# EasyEDA Pro project Uuu_sourcefile.epro

# Schematic Schematic1
Board Name: Board1; Create Date: 2026-05-01; Page Name: P1; Project Name: project four; Schematic Name: Schematic1; Update Date: 2026-05-10; Company: EasyEDA.com; Page Size: A4; Version: V1.0
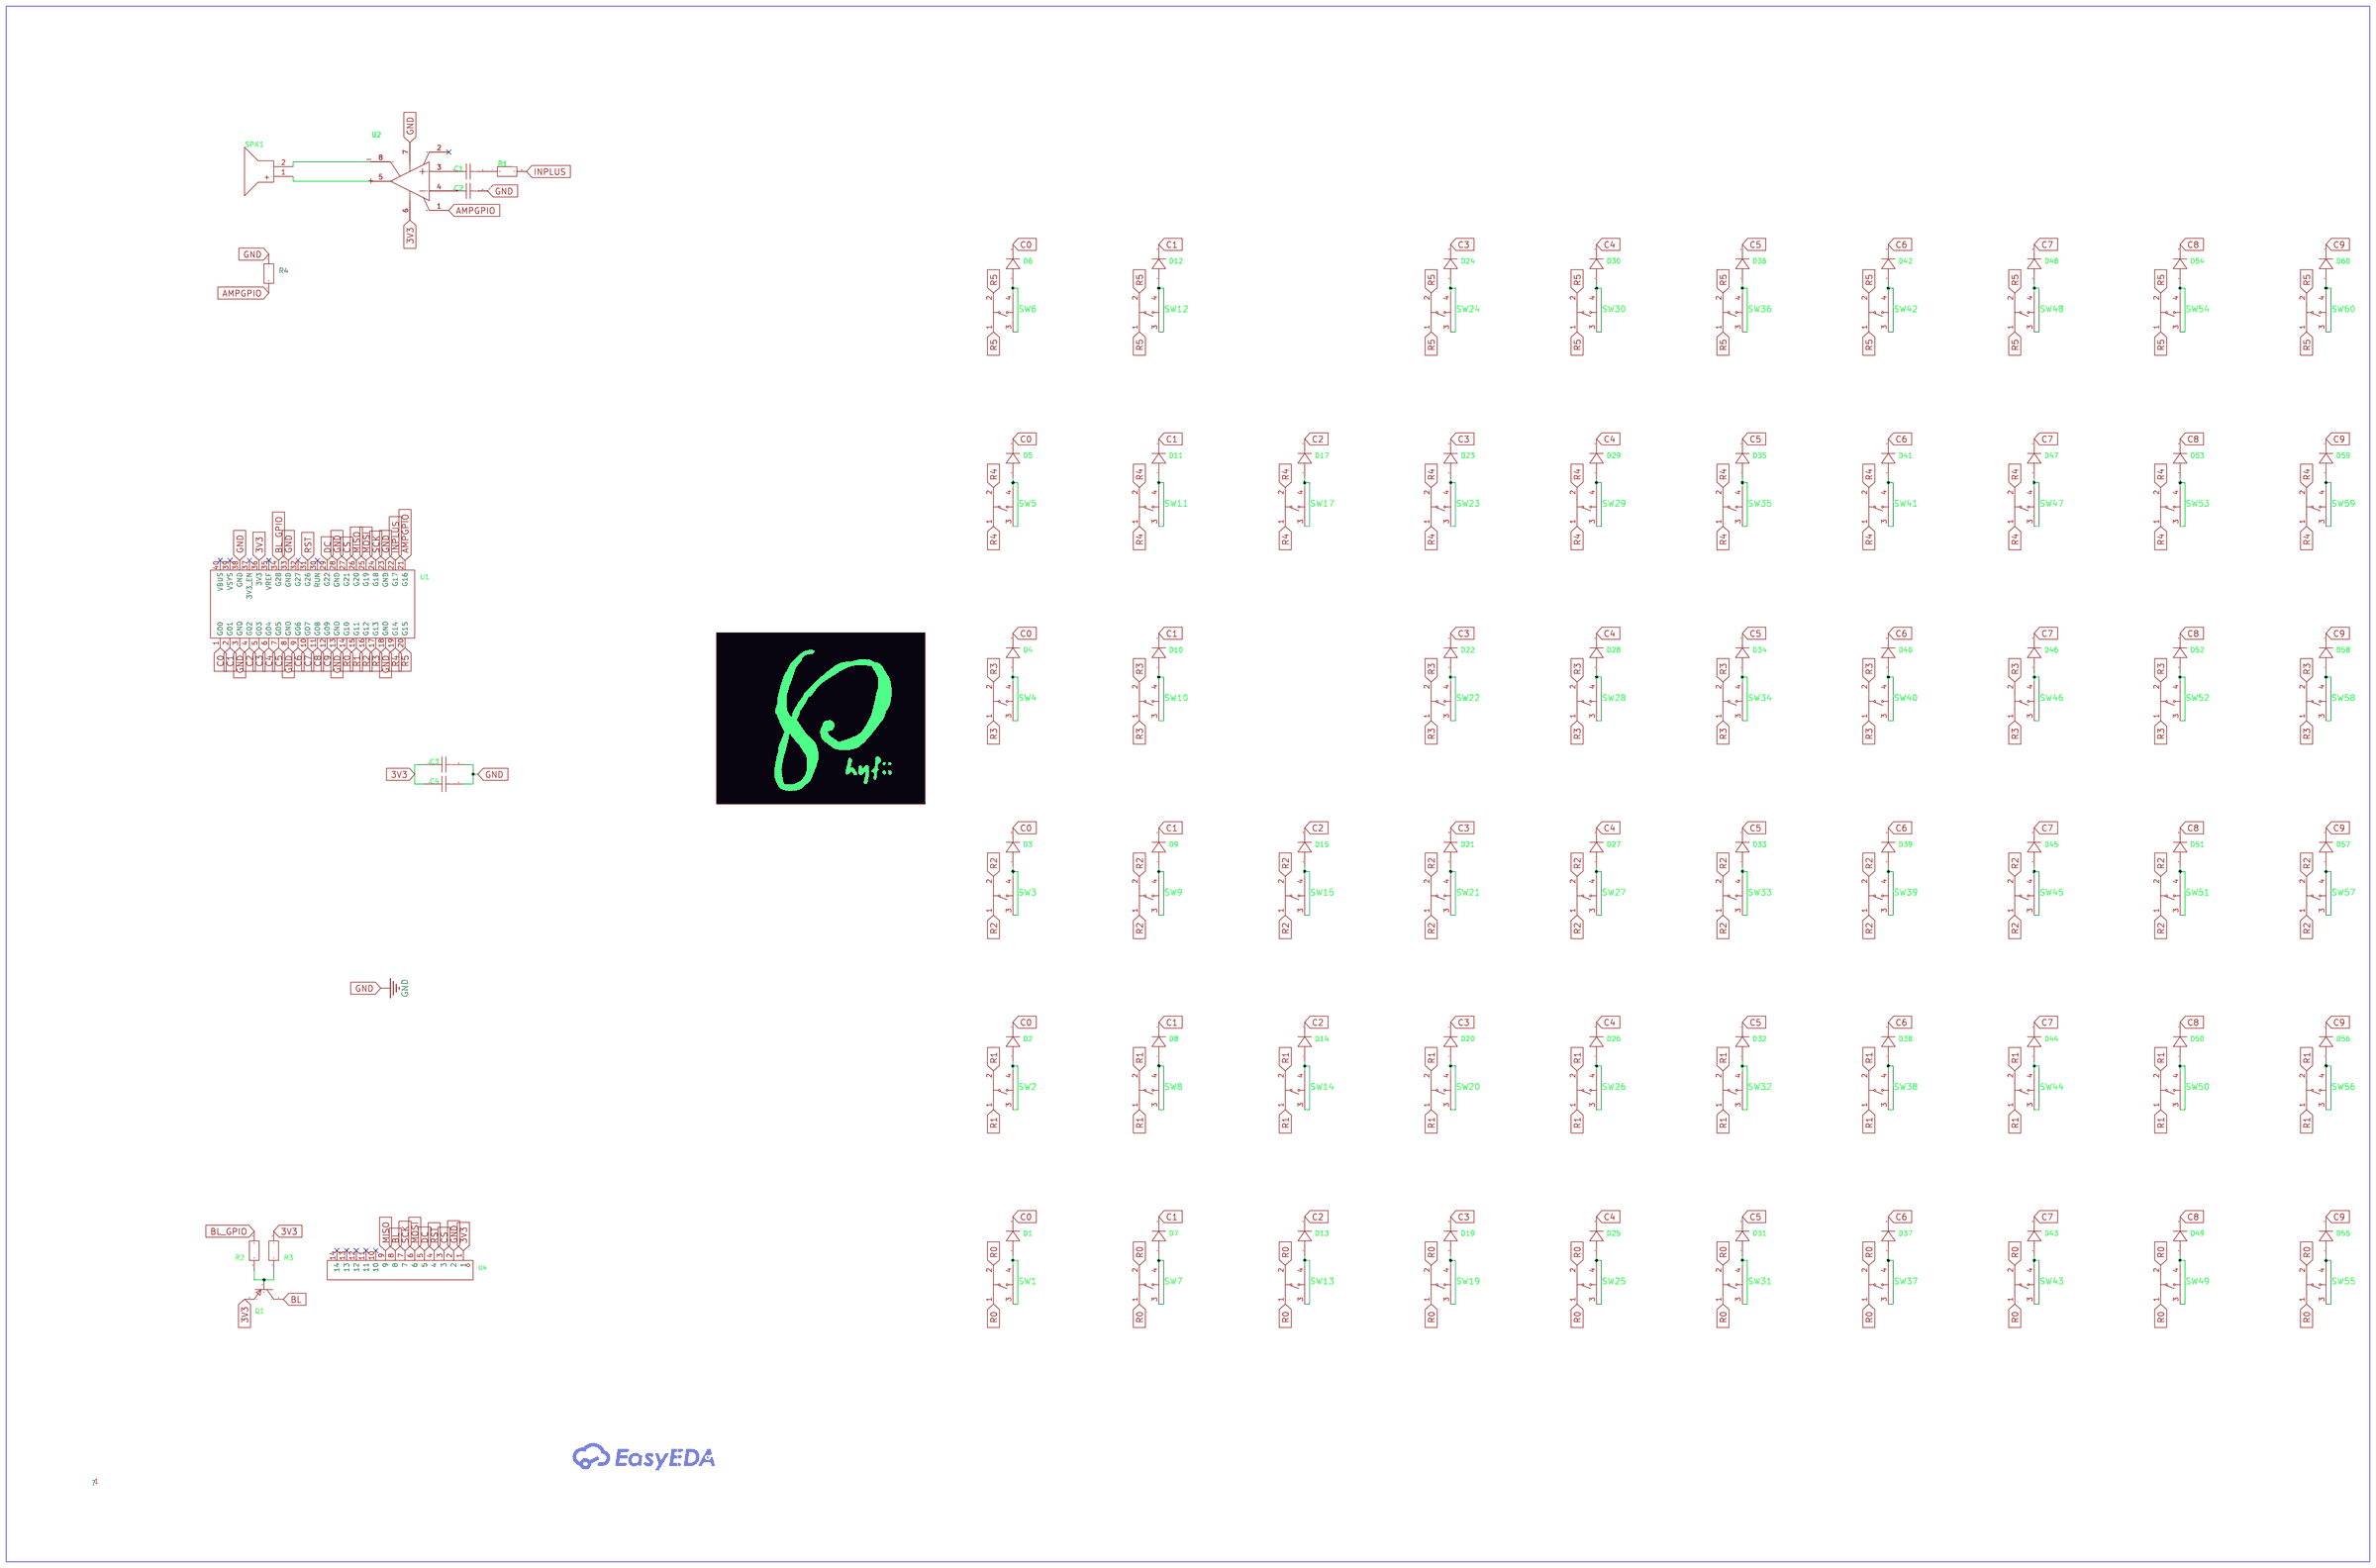
[diagram p0: schematic sheet]

## Parts
C1  100nF  [C0603]
C2  100nF  [C0603]
C3  1uF  [C0603]
C4  10uF  [C0603]
D1  1N4148  [DO-35_BD2.2-L4.0-D0.50_1N4148]
D2  1N4148  [DO-35_BD2.2-L4.0-D0.50_1N4148]
D3  1N4148  [DO-35_BD2.2-L4.0-D0.50_1N4148]
D4  1N4148  [DO-35_BD2.2-L4.0-D0.50_1N4148]
D5  1N4148  [DO-35_BD2.2-L4.0-D0.50_1N4148]
D6  1N4148  [DO-35_BD2.2-L4.0-D0.50_1N4148]
D7  1N4148  [DO-35_BD2.2-L4.0-D0.50_1N4148]
D8  1N4148  [DO-35_BD2.2-L4.0-D0.50_1N4148]
D9  1N4148  [DO-35_BD2.2-L4.0-D0.50_1N4148]
D10  1N4148  [DO-35_BD2.2-L4.0-D0.50_1N4148]
D11  1N4148  [DO-35_BD2.2-L4.0-D0.50_1N4148]
D12  1N4148  [DO-35_BD2.2-L4.0-D0.50_1N4148]
D13  1N4148  [DO-35_BD2.2-L4.0-D0.50_1N4148]
D14  1N4148  [DO-35_BD2.2-L4.0-D0.50_1N4148]
D15  1N4148  [DO-35_BD2.2-L4.0-D0.50_1N4148]
D17  1N4148  [DO-35_BD2.2-L4.0-D0.50_1N4148]
D19  1N4148  [DO-35_BD2.2-L4.0-D0.50_1N4148]
D20  1N4148  [DO-35_BD2.2-L4.0-D0.50_1N4148]
D21  1N4148  [DO-35_BD2.2-L4.0-D0.50_1N4148]
D22  1N4148  [DO-35_BD2.2-L4.0-D0.50_1N4148]
D23  1N4148  [DO-35_BD2.2-L4.0-D0.50_1N4148]
D24  1N4148  [DO-35_BD2.2-L4.0-D0.50_1N4148]
D25  1N4148  [DO-35_BD2.2-L4.0-D0.50_1N4148]
D26  1N4148  [DO-35_BD2.2-L4.0-D0.50_1N4148]
D27  1N4148  [DO-35_BD2.2-L4.0-D0.50_1N4148]
D28  1N4148  [DO-35_BD2.2-L4.0-D0.50_1N4148]
D29  1N4148  [DO-35_BD2.2-L4.0-D0.50_1N4148]
D30  1N4148  [DO-35_BD2.2-L4.0-D0.50_1N4148]
D31  1N4148  [DO-35_BD2.2-L4.0-D0.50_1N4148]
D32  1N4148  [DO-35_BD2.2-L4.0-D0.50_1N4148]
D33  1N4148  [DO-35_BD2.2-L4.0-D0.50_1N4148]
D34  1N4148  [DO-35_BD2.2-L4.0-D0.50_1N4148]
D35  1N4148  [DO-35_BD2.2-L4.0-D0.50_1N4148]
D36  1N4148  [DO-35_BD2.2-L4.0-D0.50_1N4148]
D37  1N4148  [DO-35_BD2.2-L4.0-D0.50_1N4148]
D38  1N4148  [DO-35_BD2.2-L4.0-D0.50_1N4148]
D39  1N4148  [DO-35_BD2.2-L4.0-D0.50_1N4148]
D40  1N4148  [DO-35_BD2.2-L4.0-D0.50_1N4148]
D41  1N4148  [DO-35_BD2.2-L4.0-D0.50_1N4148]
D42  1N4148  [DO-35_BD2.2-L4.0-D0.50_1N4148]
D43  1N4148  [DO-35_BD2.2-L4.0-D0.50_1N4148]
D44  1N4148  [DO-35_BD2.2-L4.0-D0.50_1N4148]
D45  1N4148  [DO-35_BD2.2-L4.0-D0.50_1N4148]
D46  1N4148  [DO-35_BD2.2-L4.0-D0.50_1N4148]
D47  1N4148  [DO-35_BD2.2-L4.0-D0.50_1N4148]
D48  1N4148  [DO-35_BD2.2-L4.0-D0.50_1N4148]
D49  1N4148  [DO-35_BD2.2-L4.0-D0.50_1N4148]
D50  1N4148  [DO-35_BD2.2-L4.0-D0.50_1N4148]
D51  1N4148  [DO-35_BD2.2-L4.0-D0.50_1N4148]
D52  1N4148  [DO-35_BD2.2-L4.0-D0.50_1N4148]
D53  1N4148  [DO-35_BD2.2-L4.0-D0.50_1N4148]
D54  1N4148  [DO-35_BD2.2-L4.0-D0.50_1N4148]
D55  1N4148  [DO-35_BD2.2-L4.0-D0.50_1N4148]
D56  1N4148  [DO-35_BD2.2-L4.0-D0.50_1N4148]
D57  1N4148  [DO-35_BD2.2-L4.0-D0.50_1N4148]
D58  1N4148  [DO-35_BD2.2-L4.0-D0.50_1N4148]
D59  1N4148  [DO-35_BD2.2-L4.0-D0.50_1N4148]
D60  1N4148  [DO-35_BD2.2-L4.0-D0.50_1N4148]
Q1  MMBT3906  [SOT-23-3_L2.9-W1.3-P1.90-LS2.4-BR]
R1  1kΩ  [R0603]
R2  10kΩ  [R0603]
R3  100kΩ  [R0603]
R4  100kΩ  [R0603]
SPK1  2308 8Ω1w  [SPK-TH_BD23.0-P10.00-D0.8-L-RD]
SW1  TS-1095PS-A1B2-C3D2  [KEY-SMD_4P-L6.0-W6.0-P3.90-LS9.0]
SW2  TS-1095PS-A1B2-C3D2  [KEY-SMD_4P-L6.0-W6.0-P3.90-LS9.0]
SW3  TS-1095PS-A1B2-C3D2  [KEY-SMD_4P-L6.0-W6.0-P3.90-LS9.0]
SW4  TS-1095PS-A1B2-C3D2  [KEY-SMD_4P-L6.0-W6.0-P3.90-LS9.0]
SW5  TS-1095PS-A1B2-C3D2  [KEY-SMD_4P-L6.0-W6.0-P3.90-LS9.0]
SW6  TS-1095PS-A1B2-C3D2  [KEY-SMD_4P-L6.0-W6.0-P3.90-LS9.0]
SW7  TS-1095PS-A1B2-C3D2  [KEY-SMD_4P-L6.0-W6.0-P3.90-LS9.0]
SW8  TS-1095PS-A1B2-C3D2  [KEY-SMD_4P-L6.0-W6.0-P3.90-LS9.0]
SW9  TS-1095PS-A1B2-C3D2  [KEY-SMD_4P-L6.0-W6.0-P3.90-LS9.0]
SW10  TS-1095PS-A1B2-C3D2  [KEY-SMD_4P-L6.0-W6.0-P3.90-LS9.0]
SW11  TS-1095PS-A1B2-C3D2  [KEY-SMD_4P-L6.0-W6.0-P3.90-LS9.0]
SW12  TS-1095PS-A1B2-C3D2  [KEY-SMD_4P-L6.0-W6.0-P3.90-LS9.0]
SW13  TS-1095PS-A1B2-C3D2  [KEY-SMD_4P-L6.0-W6.0-P3.90-LS9.0]
SW14  TS-1095PS-A1B2-C3D2  [KEY-SMD_4P-L6.0-W6.0-P3.90-LS9.0]
SW15  TS-1095PS-A1B2-C3D2  [KEY-SMD_4P-L6.0-W6.0-P3.90-LS9.0]
SW17  TS-1095PS-A1B2-C3D2  [KEY-SMD_4P-L6.0-W6.0-P3.90-LS9.0]
SW19  TS-1095PS-A1B2-C3D2  [KEY-SMD_4P-L6.0-W6.0-P3.90-LS9.0]
SW20  TS-1095PS-A1B2-C3D2  [KEY-SMD_4P-L6.0-W6.0-P3.90-LS9.0]
SW21  TS-1095PS-A1B2-C3D2  [KEY-SMD_4P-L6.0-W6.0-P3.90-LS9.0]
SW22  TS-1095PS-A1B2-C3D2  [KEY-SMD_4P-L6.0-W6.0-P3.90-LS9.0]
SW23  TS-1095PS-A1B2-C3D2  [KEY-SMD_4P-L6.0-W6.0-P3.90-LS9.0]
SW24  TS-1095PS-A1B2-C3D2  [KEY-SMD_4P-L6.0-W6.0-P3.90-LS9.0]
SW25  TS-1095PS-A1B2-C3D2  [KEY-SMD_4P-L6.0-W6.0-P3.90-LS9.0]
SW26  TS-1095PS-A1B2-C3D2  [KEY-SMD_4P-L6.0-W6.0-P3.90-LS9.0]
SW27  TS-1095PS-A1B2-C3D2  [KEY-SMD_4P-L6.0-W6.0-P3.90-LS9.0]
SW28  TS-1095PS-A1B2-C3D2  [KEY-SMD_4P-L6.0-W6.0-P3.90-LS9.0]
SW29  TS-1095PS-A1B2-C3D2  [KEY-SMD_4P-L6.0-W6.0-P3.90-LS9.0]
SW30  TS-1095PS-A1B2-C3D2  [KEY-SMD_4P-L6.0-W6.0-P3.90-LS9.0]
SW31  TS-1095PS-A1B2-C3D2  [KEY-SMD_4P-L6.0-W6.0-P3.90-LS9.0]
SW32  TS-1095PS-A1B2-C3D2  [KEY-SMD_4P-L6.0-W6.0-P3.90-LS9.0]
SW33  TS-1095PS-A1B2-C3D2  [KEY-SMD_4P-L6.0-W6.0-P3.90-LS9.0]
SW34  TS-1095PS-A1B2-C3D2  [KEY-SMD_4P-L6.0-W6.0-P3.90-LS9.0]
SW35  TS-1095PS-A1B2-C3D2  [KEY-SMD_4P-L6.0-W6.0-P3.90-LS9.0]
SW36  TS-1095PS-A1B2-C3D2  [KEY-SMD_4P-L6.0-W6.0-P3.90-LS9.0]
SW37  TS-1095PS-A1B2-C3D2  [KEY-SMD_4P-L6.0-W6.0-P3.90-LS9.0]
SW38  TS-1095PS-A1B2-C3D2  [KEY-SMD_4P-L6.0-W6.0-P3.90-LS9.0]
SW39  TS-1095PS-A1B2-C3D2  [KEY-SMD_4P-L6.0-W6.0-P3.90-LS9.0]
SW40  TS-1095PS-A1B2-C3D2  [KEY-SMD_4P-L6.0-W6.0-P3.90-LS9.0]
SW41  TS-1095PS-A1B2-C3D2  [KEY-SMD_4P-L6.0-W6.0-P3.90-LS9.0]
SW42  TS-1095PS-A1B2-C3D2  [KEY-SMD_4P-L6.0-W6.0-P3.90-LS9.0]
SW43  TS-1095PS-A1B2-C3D2  [KEY-SMD_4P-L6.0-W6.0-P3.90-LS9.0]
SW44  TS-1095PS-A1B2-C3D2  [KEY-SMD_4P-L6.0-W6.0-P3.90-LS9.0]
SW45  TS-1095PS-A1B2-C3D2  [KEY-SMD_4P-L6.0-W6.0-P3.90-LS9.0]
SW46  TS-1095PS-A1B2-C3D2  [KEY-SMD_4P-L6.0-W6.0-P3.90-LS9.0]
SW47  TS-1095PS-A1B2-C3D2  [KEY-SMD_4P-L6.0-W6.0-P3.90-LS9.0]
SW48  TS-1095PS-A1B2-C3D2  [KEY-SMD_4P-L6.0-W6.0-P3.90-LS9.0]
SW49  TS-1095PS-A1B2-C3D2  [KEY-SMD_4P-L6.0-W6.0-P3.90-LS9.0]
SW50  TS-1095PS-A1B2-C3D2  [KEY-SMD_4P-L6.0-W6.0-P3.90-LS9.0]
SW51  TS-1095PS-A1B2-C3D2  [KEY-SMD_4P-L6.0-W6.0-P3.90-LS9.0]
SW52  TS-1095PS-A1B2-C3D2  [KEY-SMD_4P-L6.0-W6.0-P3.90-LS9.0]
SW53  TS-1095PS-A1B2-C3D2  [KEY-SMD_4P-L6.0-W6.0-P3.90-LS9.0]
SW54  TS-1095PS-A1B2-C3D2  [KEY-SMD_4P-L6.0-W6.0-P3.90-LS9.0]
SW55  TS-1095PS-A1B2-C3D2  [KEY-SMD_4P-L6.0-W6.0-P3.90-LS9.0]
SW56  TS-1095PS-A1B2-C3D2  [KEY-SMD_4P-L6.0-W6.0-P3.90-LS9.0]
SW57  TS-1095PS-A1B2-C3D2  [KEY-SMD_4P-L6.0-W6.0-P3.90-LS9.0]
SW58  TS-1095PS-A1B2-C3D2  [KEY-SMD_4P-L6.0-W6.0-P3.90-LS9.0]
SW59  TS-1095PS-A1B2-C3D2  [KEY-SMD_4P-L6.0-W6.0-P3.90-LS9.0]
SW60  TS-1095PS-A1B2-C3D2  [KEY-SMD_4P-L6.0-W6.0-P3.90-LS9.0]
U1  ColorEasyPico2-RP2350  [COMM-TH_COLOREASYPICO2-RP2350]
U2  PAM8302AASCR  [MSOP-8_L3.0-W3.0-P0.65-LS5.0-BL]
U4  KH-2.54FH-1X14P-H8.5  [HDR-TH_14P-P2.54-V-F]

## Library data of the parts
C1 C2 = CGA0603X7R104K500JT: Capacitance:100nF Tolerance:±10% Tolerance:±10% Voltage Rating:50V Temperature Coefficient:X7R; LCSC Part Name: 100nF ±10% 50V; Supplier Part: C6119867; Manufacturer: HRE(芯声); Supplier Footprint: 0603; JLCPCB Part Class: Extended Part; Datasheet: https://item.szlcsc.com/datasheet/CGA0603X7R104K500JT/7062573.html; Supplier: LCSC; Tolerance: ±10%; Voltage Rating: 50V; Temperature Coefficient: X7R
C3 = CGA0603X5R105K500JT: Capacitance:1uF Tolerance:±10% Tolerance:±10% Voltage Rating:50V Temperature Coefficient:X5R; LCSC Part Name: 1uF ±10% 50V; Supplier Part: C6119852; Manufacturer: HRE(芯声); Supplier Footprint: 0603; JLCPCB Part Class: Extended Part; Datasheet: https://item.szlcsc.com/datasheet/CGA0603X5R105K500JT/7062558.html; Supplier: LCSC; Tolerance: ±10%; Voltage Rating: 50V; Temperature Coefficient: X5R
C4 = CGA0603X5R106K100JT: Capacitance:10uF Tolerance:±10% Tolerance:±10% Voltage Rating:10V Temperature Coefficient:X5R; LCSC Part Name: 10uF ±10% 10V; Supplier Part: C6119842; Manufacturer: HRE(芯声); Supplier Footprint: 0603; JLCPCB Part Class: Extended Part; Datasheet: https://item.szlcsc.com/datasheet/CGA0603X5R106K100JT/7062548.html; Supplier: LCSC; Tolerance: ±10%; Voltage Rating: 10V; Temperature Coefficient: X5R
D1-D15 D17 D19-D60 = 1N4148_C18195411: Voltage - Forward(Vf@If):1V@10mA Voltage - DC Reverse(Vr):100V Current - Rectified:150mA Pd - Power Dissipation:500mW Reverse Leakage Current (Ir):5mA Reverse Recovery Time (trr):4ns Operating Junction Temperature Range:-60℃~+200℃ Operating Junction Tempe; LCSC Part Name: 100V 150mA; Supplier Part: C18195411; Manufacturer: LJ(朗捷); Supplier Footprint: DO-35; JLCPCB Part Class: Extended Part; Datasheet: https://item.szlcsc.com/datasheet/1N4148/19344798.html; Supplier: LCSC; Voltage - Forward(Vf@If): 1V@10mA; Voltage - DC Reverse(Vr): 100V; Current - Rectified: 150mA; Pd - Power Dissipation: 500mW; Reverse Leakage Current (Ir): 5mA; Reverse Recovery Time (trr): 4ns; Operating Junction Temperature Range: -60℃~+200℃; Non-Repetitive Peak Forward Surge Current: 500mA
Q1 = MMBT3906_C5805820: type: Current - Collector(Ic):200mA Collector - Emitter Voltage VCEO:40V Pd - Power Dissipation: DC Current Gain:100@10mA,1V DC Current Gain:100@10mA,1V; Supplier Part: C5805820; Manufacturer: XZT(信展通); Supplier Footprint: SOT-23; JLCPCB Part Class: Extended Part; Datasheet: https://atta.szlcsc.com/upload/public/pdf/source/20230629/EDFB7D33DCE814F5A1700CFD3253DE4B.pdf; Supplier: LCSC; Current - Collector(Ic): 200mA; Collector - Emitter Voltage VCEO: 40V; DC Current Gain: 100@10mA,1V
R1 = FRC0603J102 TS: Type:Thick Film Resistor Resistance:1kΩ Tolerance:±5% Tolerance:±5% Power(Watts):100mW Voltage-Supply(Max):75V Temperature Coefficient:±100ppm/℃ Temperature Coefficient:±100ppm/℃ Operating Temperature:-55℃~+155℃ Operating Temperature:-55℃~+155℃; LCSC Part Name: 1kΩ ±5% 100mW 厚膜电阻; Supplier Part: C2907113; Manufacturer: FOJAN(富捷); Supplier Footprint: 0603; JLCPCB Part Class: Extended Part; Supplier: LCSC; Type: Thick Film Resistor; Tolerance: ±5%; Power(Watts): 100mW; Voltage-Supply(Max): 75V; Temperature Coefficient: ±100ppm/℃; Operating Temperature: -55℃~+155℃
R2 = FRC0603F1002TS: Type:Thick Film Resistor Resistance:10kΩ Tolerance:±1% Tolerance:±1% Power(Watts):100mW Voltage-Supply(Max):75V Temperature Coefficient:±100ppm/℃ Temperature Coefficient:±100ppm/℃ Operating Temperature:-55℃~+155℃ Operating Temperature:-55℃~+155℃; LCSC Part Name: 10kΩ ±1% 100mW 厚膜电阻; Supplier Part: C2906982; Manufacturer: FOJAN(富捷); Supplier Footprint: 0603; JLCPCB Part Class: Extended Part; Supplier: LCSC; Type: Thick Film Resistor; Tolerance: ±1%; Power(Watts): 100mW; Voltage-Supply(Max): 75V; Temperature Coefficient: ±100ppm/℃; Operating Temperature: -55℃~+155℃
R3 R4 = FRC0603J104 TS: Type:Thick Film Resistor Resistance:100kΩ Tolerance:±5% Tolerance:±5% Power(Watts):100mW Voltage-Supply(Max):75V Temperature Coefficient:±100ppm/℃ Temperature Coefficient:±100ppm/℃ Operating Temperature:-55℃~+155℃ Operating Temperature:-55℃~+155℃; LCSC Part Name: 100kΩ ±5% 100mW 厚膜电阻; Supplier Part: C2907088; Manufacturer: FOJAN(富捷); Supplier Footprint: 0603; JLCPCB Part Class: Extended Part; Supplier: LCSC; Type: Thick Film Resistor; Tolerance: ±5%; Power(Watts): 100mW; Voltage-Supply(Max): 75V; Temperature Coefficient: ±100ppm/℃; Operating Temperature: -55℃~+155℃
SPK1 = 2308 8Ω1w: Technology:Electromagnetic Frequency Range:1.65kHz~10kHz Frequency Range:1.65kHz~10kHz Impedance:8Ω Resonant Frequency:1.65kHz Rated Power:1W Sound Pressure Level(SPL):88dB Diameter(φD):23mm Height:8mm Operating Temperature:-20℃~+60℃ Operating Temperature; LCSC Part Name: 2308插针喇叭8欧1瓦带腔; Supplier Part: C49304674; Manufacturer: S&S(海旭); Supplier Footprint: 插件,D23xL8mm; JLCPCB Part Class: Extended Part; Datasheet: https://item.szlcsc.com/datasheet/2308%25208%25CE%25A91w/51765047.html; Supplier: LCSC; Technology: Electromagnetic; Frequency Range: 1.65kHz~10kHz; Impedance: 8Ω; Resonant Frequency: 1.65kHz; Rated Power: 1W; Sound Pressure Level(SPL): 88dB; Diameter(φD): 23mm; Height: 8mm; Operating Temperature: -20℃~+60℃; Lead Pitch: 10mm
SW1-SW15 SW17 SW19-SW60 = TS-1095PS-A1B2-C3D2: Circuit:SPST Actuator Style:Round Button Operating Force:1.8N Mounting Type:Surface Mount,Vertical Length:6mm Width:6mm Switch Height:4.3mm with Bracket:Without Bracket Actuator/Cap Color:Black Termination Style:Gull Wing Life:-; LCSC Part Name: 6*6*4.3mm 立贴 轻触开关; Supplier Part: C2834918; Manufacturer: Yuandi(元迪); Supplier Footprint: SMD-4P,6x6mm; JLCPCB Part Class: Extended Part; Datasheet: https://item.szlcsc.com/datasheet/TS-1095PS-A1B2-C3D2/2997598.html; Supplier: LCSC; Circuit: SPST; Actuator Style: Round Button; Operating Force: 1.8N; Mounting Type: Surface Mount,Vertical; Length: 6mm; Width: 6mm; Switch Height: 4.3mm; with Bracket: Without Bracket; Actuator/Cap Color: Black; Termination Style: Gull Wing
U1 = ColorEasyPico2-RP2350: LCSC Part Name: 立创·ColorEasyPico2开发板; Supplier Part: C42924268; Manufacturer: 立创开发板; JLCPCB Part Class: Extended Part; Datasheet: https://item.szlcsc.com/datasheet/ColorEasyPico2-RP2350/45024583.html; Supplier: LCSC
U2 = PAM8302AASCR: Class:Class D Speaker Channels:1-Channel Output Power:2.5Wx1@4Ω Voltage - Supply:2V~5.5V Voltage - Supply:2V~5.5V Total Harmonic Distortion + Noise (THD+N):0.3% Quiescent Current:4mA Operating Temperature:-40℃~+85℃ Operating Temperature:-40℃~+85℃ Signal-t; LCSC Part Name: 2.5W单声道D类音频功率放大器; Supplier Part: C113367; Manufacturer: DIODES(美台); Supplier Footprint: MSOP-8; JLCPCB Part Class: Extended Part; Datasheet: https://item.szlcsc.com/datasheet/PAM8302AASCR/114602.html; Supplier: LCSC; Class: Class D; Speaker Channels: 1-Channel; Output Power: 2.5Wx1@4Ω; Voltage - Supply: 2V~5.5V; Total Harmonic Distortion + Noise (THD+N): 0.3%; Quiescent Current: 4mA; Operating Temperature: -40℃~+85℃; Signal-to-Noise Ratio: 80dB; Power Supply Rejection Ratio (PSRR): 50dB; Efficiency: 85%
U4 = KH-2.54FH-1X14P-H8.5: Holes Structure:1x14P Pitch:2.54mm Row Spacing:- Circular Hole / Square Hole:Square Hole Mounting Type:Through Hole Number of Rows:1 Number of Positions:14P Current Rating:3A Voltage Rating (Max):- Holes Direction:Top Insulation Height:8.5mm Operating Tem; LCSC Part Name: 间距:2.54mm 1x14P 直插; Supplier Part: C2905420; Manufacturer: kinghelm(金航标); Supplier Footprint: 插件,P=2.54mm; JLCPCB Part Class: Extended Part; Datasheet: https://item.szlcsc.com/datasheet/KH-2.54FH-1X14P-H8.5/3175194.html; Supplier: LCSC; Holes Structure: 1x14P; Pitch: 2.54mm; Circular Hole / Square Hole: Square Hole; Mounting Type: Through Hole; Number of Rows: 1; Number of Positions: 14P; Current Rating: 3A; Holes Direction: Top; Insulation Height: 8.5mm; Operating Temperature: -40℃~+105℃

## Nets
3V3: C3.1 C4.1 Q1.2(E) R3.2 U1.36(3V3) U2.6(VDD) U4.1
GND: C2.2 C3.2 C4.2 R4.1 U1.3(GND) U1.8(GND) U1.13(GND) U1.18(GND) U1.23(GND) U1.28(GND) U1.33(GND) U1.38(GND) U2.7(GND) U4.2
AMPGPIO: R4.2 U1.21(G16) U2.1(SD#)
BL: Q1.3(C) U4.8
BL_GPIO: R2.2 U1.34(G28)
C0: D1.2(C) D2.2(C) D3.2(C) D4.2(C) D5.2(C) D6.2(C) U1.1(G00)
C1: D7.2(C) D8.2(C) D9.2(C) D10.2(C) D11.2(C) D12.2(C) U1.2(G01)
C2: D13.2(C) D14.2(C) D15.2(C) D17.2(C) U1.4(G02)
C3: D19.2(C) D20.2(C) D21.2(C) D22.2(C) D23.2(C) D24.2(C) U1.5(G03)
C4: D25.2(C) D26.2(C) D27.2(C) D28.2(C) D29.2(C) D30.2(C) U1.6(G04)
C5: D31.2(C) D32.2(C) D33.2(C) D34.2(C) D35.2(C) D36.2(C) U1.7(G05)
C6: D37.2(C) D38.2(C) D39.2(C) D40.2(C) D41.2(C) D42.2(C) U1.9(G06)
C7: D43.2(C) D44.2(C) D45.2(C) D46.2(C) D47.2(C) D48.2(C) U1.10(G07)
C8: D49.2(C) D50.2(C) D51.2(C) D52.2(C) D53.2(C) D54.2(C) U1.11(G08)
C9: D55.2(C) D56.2(C) D57.2(C) D58.2(C) D59.2(C) D60.2(C) U1.12(G09)
CS: U1.27(G21) U4.3
DC: U1.29(G22) U4.5
INPLUS: R1.2 U1.22(G17)
MISO: U1.26(G20) U4.9
MOSI: U1.25(G19) U4.6
R0: SW1.1 SW1.2 SW7.1 SW7.2 SW13.1 SW13.2 SW19.1 SW19.2 SW25.1 SW25.2 SW31.1 SW31.2 SW37.1 SW37.2 SW43.1 SW43.2 SW49.1 SW49.2 SW55.1 SW55.2 U1.14(G10)
R1: SW2.1 SW2.2 SW8.1 SW8.2 SW14.1 SW14.2 SW20.1 SW20.2 SW26.1 SW26.2 SW32.1 SW32.2 SW38.1 SW38.2 SW44.1 SW44.2 SW50.1 SW50.2 SW56.1 SW56.2 U1.15(G11)
R2: SW3.1 SW3.2 SW9.1 SW9.2 SW15.1 SW15.2 SW21.1 SW21.2 SW27.1 SW27.2 SW33.1 SW33.2 SW39.1 SW39.2 SW45.1 SW45.2 SW51.1 SW51.2 SW57.1 SW57.2 U1.16(G12)
R3: SW4.1 SW4.2 SW10.1 SW10.2 SW22.1 SW22.2 SW28.1 SW28.2 SW34.1 SW34.2 SW40.1 SW40.2 SW46.1 SW46.2 SW52.1 SW52.2 SW58.1 SW58.2 U1.17(G13)
R4: SW5.1 SW5.2 SW11.1 SW11.2 SW17.1 SW17.2 SW23.1 SW23.2 SW29.1 SW29.2 SW35.1 SW35.2 SW41.1 SW41.2 SW47.1 SW47.2 SW53.1 SW53.2 SW59.1 SW59.2 U1.19(G14)
R5: SW6.1 SW6.2 SW12.1 SW12.2 SW24.1 SW24.2 SW30.1 SW30.2 SW36.1 SW36.2 SW42.1 SW42.2 SW48.1 SW48.2 SW54.1 SW54.2 SW60.1 SW60.2 U1.20(G15)
RST: U1.31(G26) U4.4
SCK: U1.24(G18) U4.7
$1N8407: D1.1(A) SW1.3 SW1.4
$1N10171: D2.1(A) SW2.3 SW2.4
$1N10276: D4.1(A) SW4.3 SW4.4
$1N10284: D3.1(A) SW3.3 SW3.4
$1N10390: D6.1(A) SW6.3 SW6.4
$1N10398: D5.1(A) SW5.3 SW5.4
$1N11038: D11.1(A) SW11.3 SW11.4
$1N11044: D12.1(A) SW12.3 SW12.4
$1N11054: D10.1(A) SW10.3 SW10.4
$1N11060: D9.1(A) SW9.3 SW9.4
$1N11066: D8.1(A) SW8.3 SW8.4
$1N11072: D7.1(A) SW7.3 SW7.4
$1N11320: D13.1(A) SW13.3 SW13.4
$1N11326: D14.1(A) SW14.3 SW14.4
$1N11332: D15.1(A) SW15.3 SW15.4
$1N11344: D17.1(A) SW17.3 SW17.4
$1N11596: D19.1(A) SW19.3 SW19.4
$1N11602: D20.1(A) SW20.3 SW20.4
$1N11608: D21.1(A) SW21.3 SW21.4
$1N11614: D22.1(A) SW22.3 SW22.4
$1N11620: D23.1(A) SW23.3 SW23.4
$1N11626: D24.1(A) SW24.3 SW24.4
$1N11872: D25.1(A) SW25.3 SW25.4
$1N11878: D26.1(A) SW26.3 SW26.4
$1N11884: D27.1(A) SW27.3 SW27.4
$1N11890: D28.1(A) SW28.3 SW28.4
$1N11896: D29.1(A) SW29.3 SW29.4
$1N11902: D30.1(A) SW30.3 SW30.4
$1N12148: D31.1(A) SW31.3 SW31.4
$1N12154: D32.1(A) SW32.3 SW32.4
$1N12160: D33.1(A) SW33.3 SW33.4
$1N12166: D34.1(A) SW34.3 SW34.4
$1N12172: D35.1(A) SW35.3 SW35.4
$1N12178: D36.1(A) SW36.3 SW36.4
$1N12424: D37.1(A) SW37.3 SW37.4
$1N12430: D38.1(A) SW38.3 SW38.4
$1N12436: D39.1(A) SW39.3 SW39.4
$1N12442: D40.1(A) SW40.3 SW40.4
$1N12448: D41.1(A) SW41.3 SW41.4
$1N12454: D42.1(A) SW42.3 SW42.4
$1N12700: D43.1(A) SW43.3 SW43.4
$1N12706: D44.1(A) SW44.3 SW44.4
$1N12712: D45.1(A) SW45.3 SW45.4
$1N12718: D46.1(A) SW46.3 SW46.4
$1N12724: D47.1(A) SW47.3 SW47.4
$1N12730: D48.1(A) SW48.3 SW48.4
$1N12976: D49.1(A) SW49.3 SW49.4
$1N12982: D50.1(A) SW50.3 SW50.4
$1N12988: D51.1(A) SW51.3 SW51.4
$1N12994: D52.1(A) SW52.3 SW52.4
$1N13000: D53.1(A) SW53.3 SW53.4
$1N13006: D54.1(A) SW54.3 SW54.4
$1N13252: D55.1(A) SW55.3 SW55.4
$1N13258: D56.1(A) SW56.3 SW56.4
$1N13264: D57.1(A) SW57.3 SW57.4
$1N13270: D58.1(A) SW58.3 SW58.4
$1N13276: D59.1(A) SW59.3 SW59.4
$1N13282: D60.1(A) SW60.3 SW60.4
$1N22901: SPK1.2(-) U2.8(VO-)
$1N22906: SPK1.1(+) U2.5(VO+)
$1N23027: C1.1 U2.3(IN+)
$1N23100: C1.2 R1.1
$1N23235: C2.1 U2.4(IN-)
$1N52039: Q1.1(B) R2.1 R3.1

Not connected (* = marked no-connect by the designer): U1 30(RUN)* 32(G27)* 35(VREF)* 37(3V3_EN)* 39(VSYS)* 40(VBUS)*; U2 2(NC)*; U4 10* 11* 12* 13* 14*

## Notes on the sheet
- 58 button matrix (6 x 10) - 2
- speaker & amplifier
- microcontroller
- GND
- 14pin header for display

# Board PCB1
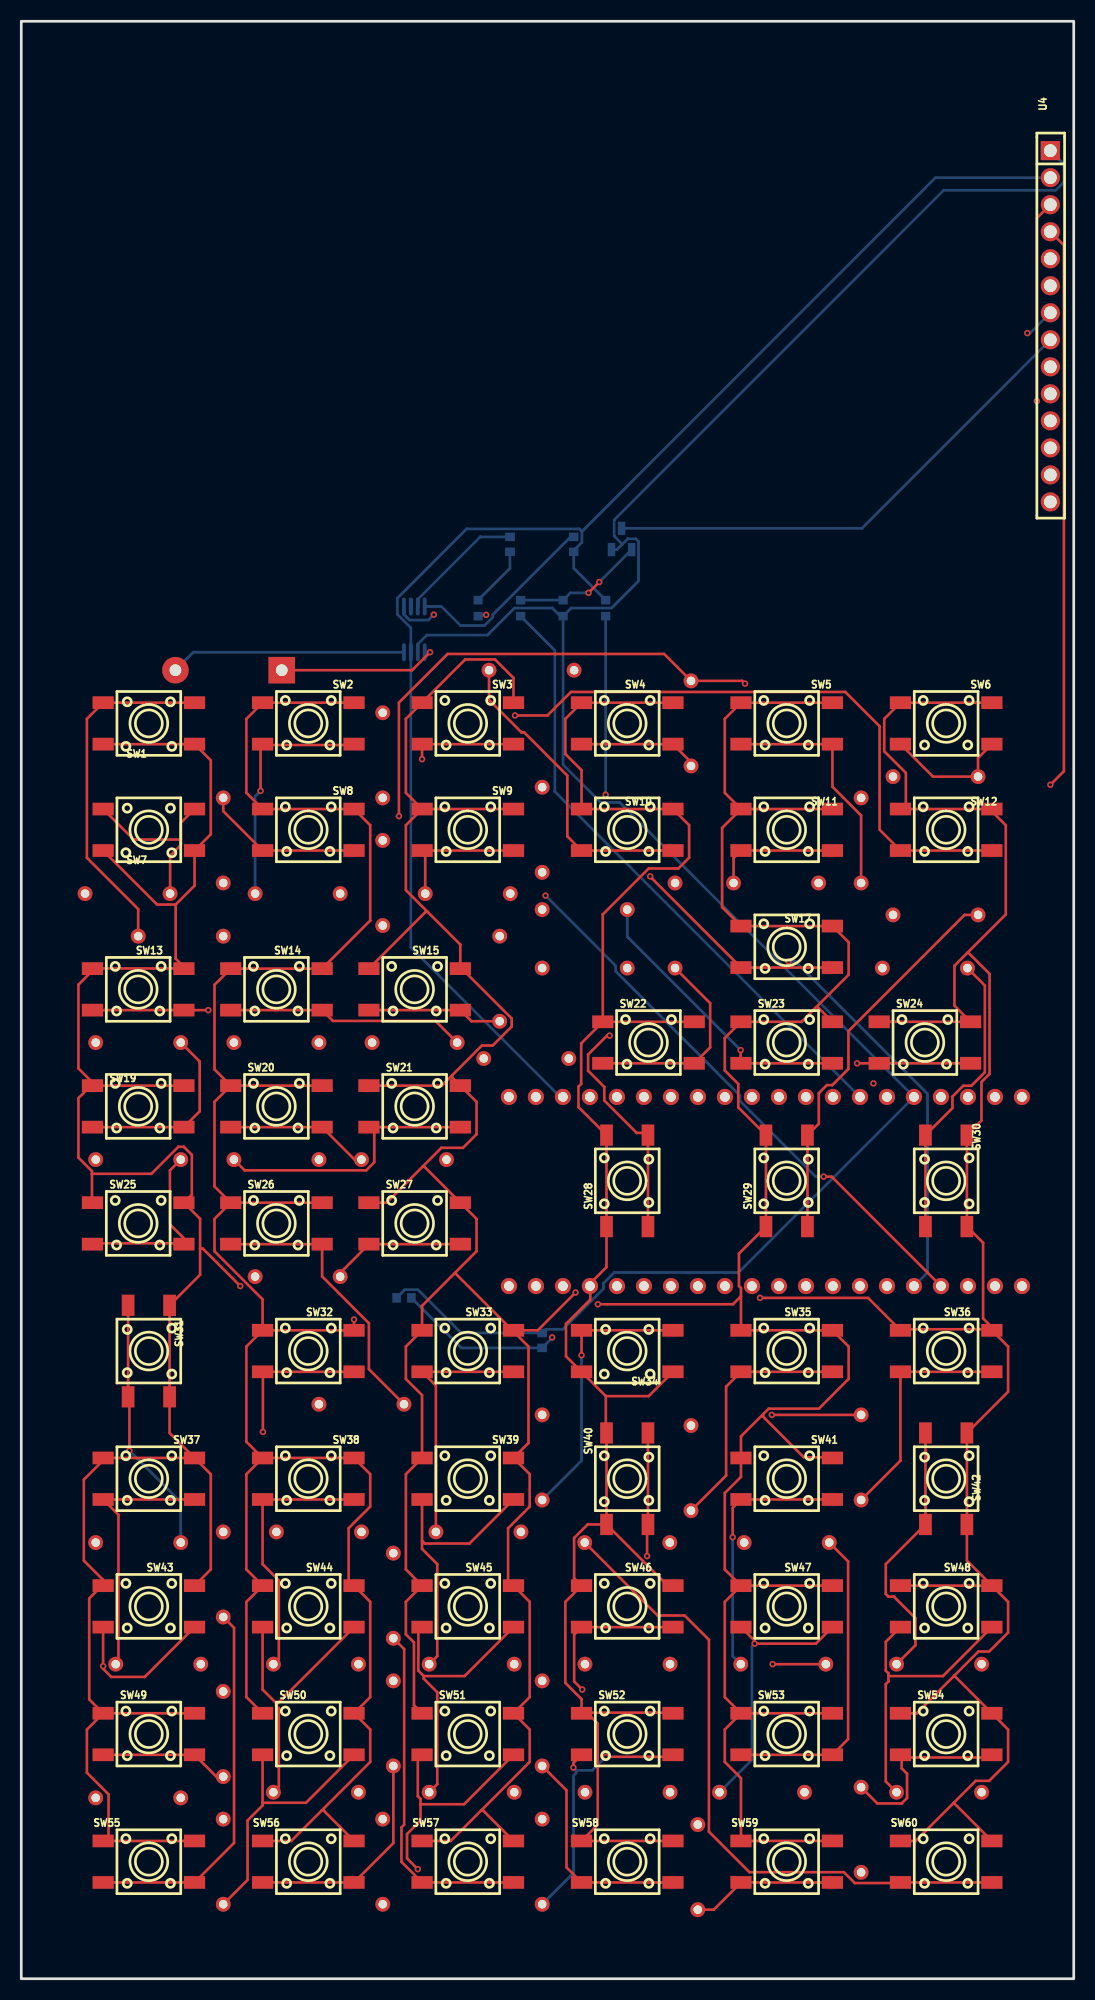
[diagram p1: board, top side]
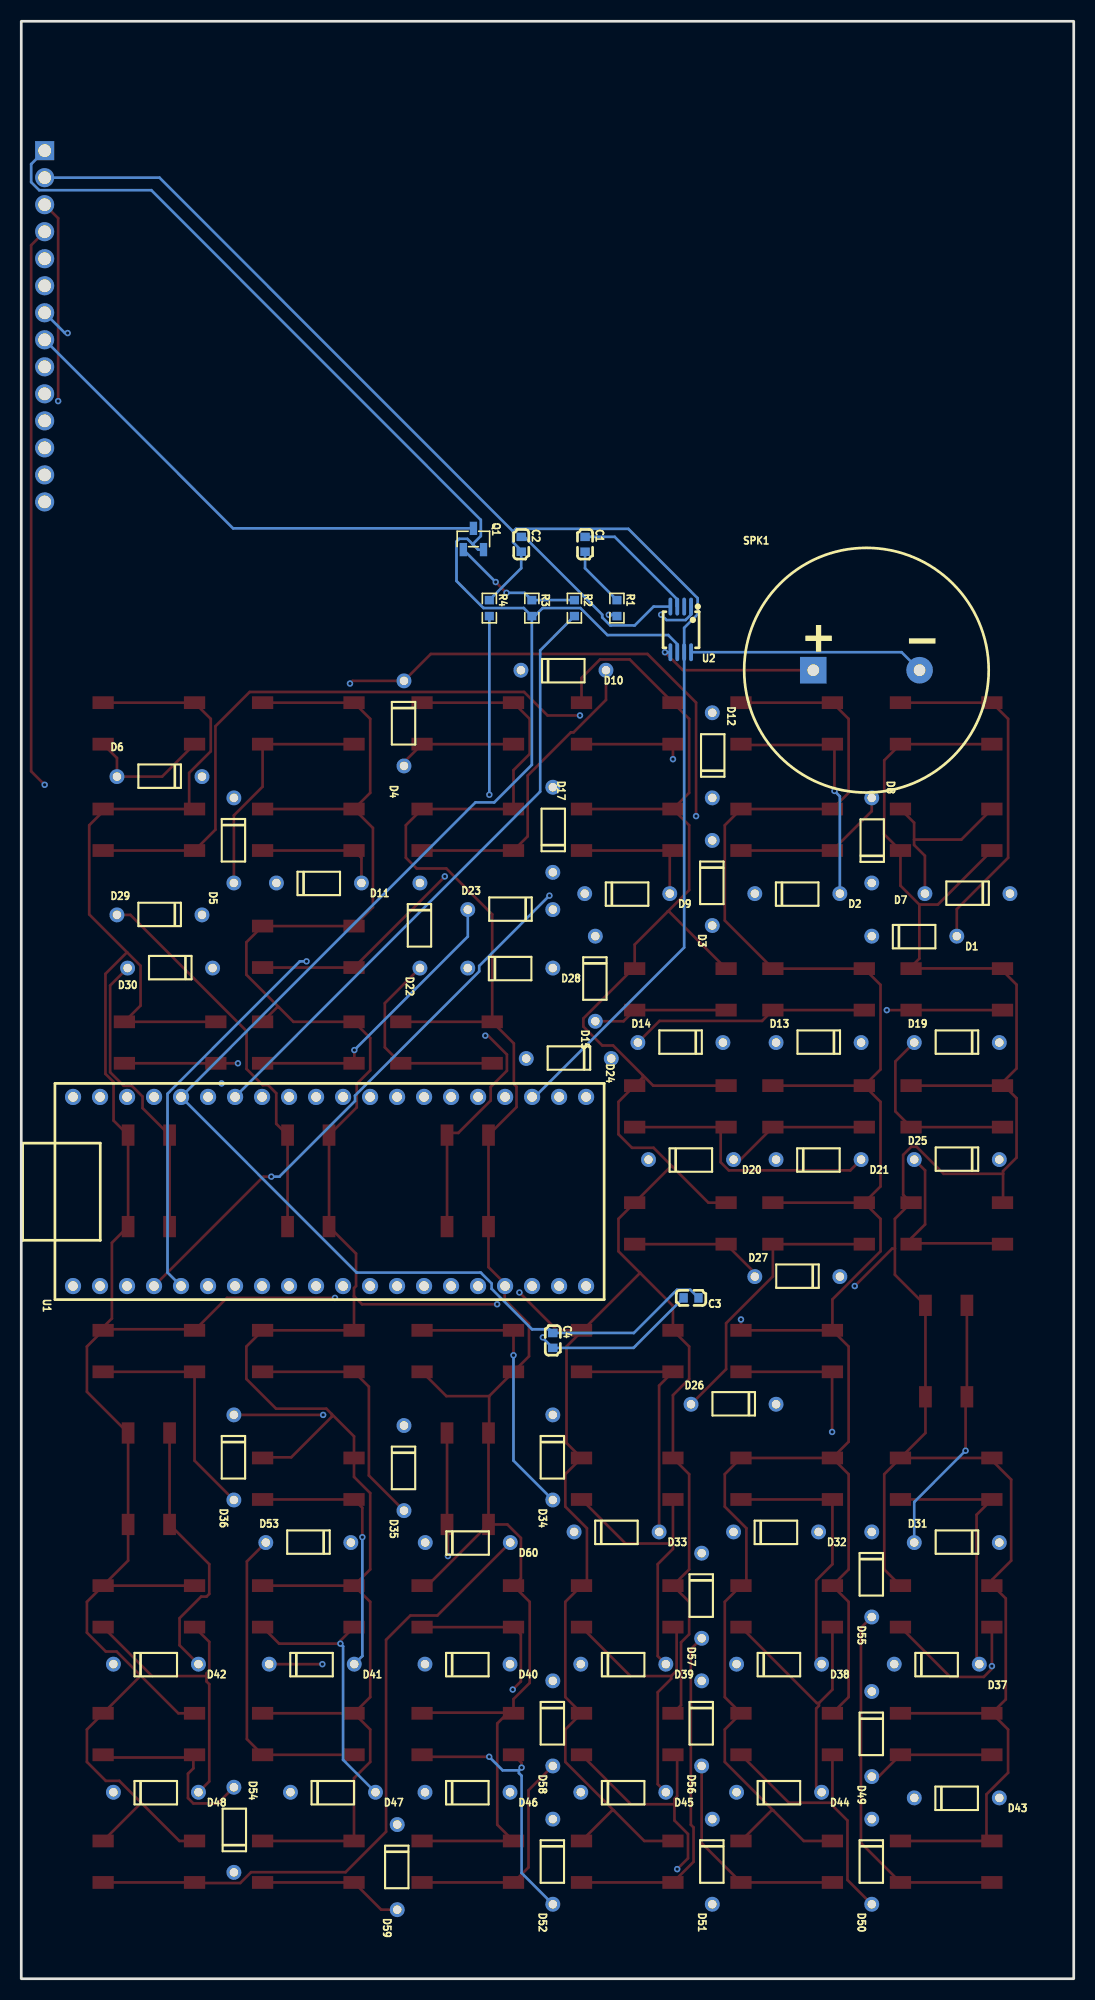
[diagram p2: board, bottom side, seen from below]

Outline 99 x 184 mm; copper layers: Top Layer, Inner1, Inner2, Bottom Layer. Coordinates in mm from the lower left corner of the outline.
Outline path: rectangle 0,184 99,0
Stack: Top Layer 0.035mm Outer layer thickness 1oz / Dielectric1 0.2104mm 7628 RC49% 8.6mil / Inner1 0.0152mm Inner layer thickness / Dielectric2 1.065mm 1.1mm H/HOZ Copper / Inner2 0.0152mm Inner layer thickness / Dielectric3 0.2104mm 7628 RC49% 8.6mil / Bottom Layer 0.035mm Outer layer thickness 1oz

## Design rules (mm)
template: JLCPCB Capability(Two Layers Board)
spacing copperThickness1oz (default): track to track 0.102, other pairs 0.152 to 0.3
spacing copperThickness2oz: track to track 0.203, other pairs 0.152 to 0.3
track width copperThickness1oz (default): min 0.127, default 0.254, max 2.54
track width copperThickness2oz: min 0.203, default 0.254, max 2.54
differential pair differentialPair (default): width min 0.127, default 0.254, max 2.54; gap min 0.152, default 0.152
via viaSize (default): diameter min 0.5, default 0.61, max 10; hole min 0.3, default 0.305, max 6.3

## Placement (name value [footprint] x y rotation side)
C1  100nF  [C0603]  45.97 134.84 270 bottom
C2  100nF  [C0603]  51.97 134.84 270 bottom
C3  1uF  [C0603]  36 64 0 bottom
C4  10uF  [C0603]  49 60 270 bottom
D1  1N4148  [DO-35_BD2.2-L4.0-D0.50_1N4148]  15 98 0 bottom
D2  1N4148  [DO-35_BD2.2-L4.0-D0.50_1N4148]  26 102 0 bottom
D3  1N4148  [DO-35_BD2.2-L4.0-D0.50_1N4148]  34 103 90 bottom
D4  1N4148  [DO-35_BD2.2-L4.0-D0.50_1N4148]  63 118 90 bottom
D5  1N4148  [DO-35_BD2.2-L4.0-D0.50_1N4148]  79 107 90 bottom
D6  1N4148  [DO-35_BD2.2-L4.0-D0.50_1N4148]  86 113 180 bottom
D7  1N4148  [DO-35_BD2.2-L4.0-D0.50_1N4148]  10 102 180 bottom
D8  1N4148  [DO-35_BD2.2-L4.0-D0.50_1N4148]  19 107 270 bottom
D9  1N4148  [DO-35_BD2.2-L4.0-D0.50_1N4148]  42 102 0 bottom
D10  1N4148  [DO-35_BD2.2-L4.0-D0.50_1N4148]  48 123 0 bottom
D11  1N4148  [DO-35_BD2.2-L4.0-D0.50_1N4148]  71 103 0 bottom
D12  1N4148  [DO-35_BD2.2-L4.0-D0.50_1N4148]  34 115 270 bottom
D13  1N4148  [DO-35_BD2.2-L4.0-D0.50_1N4148]  24 88 180 bottom
D14  1N4148  [DO-35_BD2.2-L4.0-D0.50_1N4148]  37 88 180 bottom
D15  1N4148  [DO-35_BD2.2-L4.0-D0.50_1N4148]  45 94 90 bottom
D17  1N4148  [DO-35_BD2.2-L4.0-D0.50_1N4148]  49 108 270 bottom
D19  1N4148  [DO-35_BD2.2-L4.0-D0.50_1N4148]  11 88 180 bottom
D20  1N4148  [DO-35_BD2.2-L4.0-D0.50_1N4148]  36 77 0 bottom
D21  1N4148  [DO-35_BD2.2-L4.0-D0.50_1N4148]  24 77 0 bottom
D22  1N4148  [DO-35_BD2.2-L4.0-D0.50_1N4148]  61.5 99 90 bottom
D23  1N4148  [DO-35_BD2.2-L4.0-D0.50_1N4148]  53 100.5 180 bottom
D24  1N4148  [DO-35_BD2.2-L4.0-D0.50_1N4148]  47.5 86.5 180 bottom
D25  1N4148  [DO-35_BD2.2-L4.0-D0.50_1N4148]  11 77 180 bottom
D26  1N4148  [DO-35_BD2.2-L4.0-D0.50_1N4148]  32 54 180 bottom
D27  1N4148  [DO-35_BD2.2-L4.0-D0.50_1N4148]  26 66 180 bottom
D28  1N4148  [DO-35_BD2.2-L4.0-D0.50_1N4148]  53 95 0 bottom
D29  1N4148  [DO-35_BD2.2-L4.0-D0.50_1N4148]  86 100 180 bottom
D30  1N4148  [DO-35_BD2.2-L4.0-D0.50_1N4148]  85 95 180 bottom
D31  1N4148  [DO-35_BD2.2-L4.0-D0.50_1N4148]  11 41 180 bottom
D32  1N4148  [DO-35_BD2.2-L4.0-D0.50_1N4148]  28 42 0 bottom
D33  1N4148  [DO-35_BD2.2-L4.0-D0.50_1N4148]  43 42 0 bottom
D34  1N4148  [DO-35_BD2.2-L4.0-D0.50_1N4148]  49 49 90 bottom
D35  1N4148  [DO-35_BD2.2-L4.0-D0.50_1N4148]  63 48 90 bottom
D36  1N4148  [DO-35_BD2.2-L4.0-D0.50_1N4148]  79 49 90 bottom
D37  1N4148  [DO-35_BD2.2-L4.0-D0.50_1N4148]  12.88 29.57 0 bottom
D38  1N4148  [DO-35_BD2.2-L4.0-D0.50_1N4148]  27.72 29.57 0 bottom
D39  1N4148  [DO-35_BD2.2-L4.0-D0.50_1N4148]  42.37 29.57 0 bottom
D40  1N4148  [DO-35_BD2.2-L4.0-D0.50_1N4148]  57.02 29.57 0 bottom
D41  1N4148  [DO-35_BD2.2-L4.0-D0.50_1N4148]  71.68 29.57 0 bottom
D42  1N4148  [DO-35_BD2.2-L4.0-D0.50_1N4148]  86.33 29.57 0 bottom
D43  1N4148  [DO-35_BD2.2-L4.0-D0.50_1N4148]  11 17 0 bottom
D44  1N4148  [DO-35_BD2.2-L4.0-D0.50_1N4148]  27.72 17.53 0 bottom
D45  1N4148  [DO-35_BD2.2-L4.0-D0.50_1N4148]  42.37 17.53 0 bottom
D46  1N4148  [DO-35_BD2.2-L4.0-D0.50_1N4148]  57.02 17.53 0 bottom
D47  1N4148  [DO-35_BD2.2-L4.0-D0.50_1N4148]  69.68 17.53 0 bottom
D48  1N4148  [DO-35_BD2.2-L4.0-D0.50_1N4148]  86.33 17.53 0 bottom
D49  1N4148  [DO-35_BD2.2-L4.0-D0.50_1N4148]  19 23 90 bottom
D50  1N4148  [DO-35_BD2.2-L4.0-D0.50_1N4148]  19 11 90 bottom
D51  1N4148  [DO-35_BD2.2-L4.0-D0.50_1N4148]  34 11 90 bottom
D52  1N4148  [DO-35_BD2.2-L4.0-D0.50_1N4148]  49 11 90 bottom
D53  1N4148  [DO-35_BD2.2-L4.0-D0.50_1N4148]  72 41 180 bottom
D54  1N4148  [DO-35_BD2.2-L4.0-D0.50_1N4148]  79 14 270 bottom
D55  1N4148  [DO-35_BD2.2-L4.0-D0.50_1N4148]  19 38 90 bottom
D56  1N4148  [DO-35_BD2.2-L4.0-D0.50_1N4148]  35 24 90 bottom
D57  1N4148  [DO-35_BD2.2-L4.0-D0.50_1N4148]  35 36 90 bottom
D58  1N4148  [DO-35_BD2.2-L4.0-D0.50_1N4148]  49 24 90 bottom
D59  1N4148  [DO-35_BD2.2-L4.0-D0.50_1N4148]  63.64 10.49 90 bottom
D60  1N4148  [DO-35_BD2.2-L4.0-D0.50_1N4148]  57 41 0 bottom
Q1  MMBT3906  [SOT-23-3_L2.9-W1.3-P1.90-LS2.4-BR]  56.47 135.34 270 bottom
R1  1kΩ  [R0603]  42.97 128.84 270 bottom
R2  10kΩ  [R0603]  46.97 128.84 270 bottom
R3  100kΩ  [R0603]  50.97 128.84 270 bottom
R4  100kΩ  [R0603]  54.97 128.84 270 bottom
SPK1  2308 8Ω1w  [SPK-TH_BD23.0-P10.00-D0.8-L-RD]  19.5 123 180 bottom
SW1  TS-1095PS-A1B2-C3D2  [KEY-SMD_4P-L6.0-W6.0-P3.90-LS9.0]  12 118 180 top
SW2  TS-1095PS-A1B2-C3D2  [KEY-SMD_4P-L6.0-W6.0-P3.90-LS9.0]  27 118 0 top
SW3  TS-1095PS-A1B2-C3D2  [KEY-SMD_4P-L6.0-W6.0-P3.90-LS9.0]  42 118 0 top
SW4  TS-1095PS-A1B2-C3D2  [KEY-SMD_4P-L6.0-W6.0-P3.90-LS9.0]  57 118 0 top
SW5  TS-1095PS-A1B2-C3D2  [KEY-SMD_4P-L6.0-W6.0-P3.90-LS9.0]  72 118 0 top
SW6  TS-1095PS-A1B2-C3D2  [KEY-SMD_4P-L6.0-W6.0-P3.90-LS9.0]  87 118 0 top
SW7  TS-1095PS-A1B2-C3D2  [KEY-SMD_4P-L6.0-W6.0-P3.90-LS9.0]  12 108 180 top
SW8  TS-1095PS-A1B2-C3D2  [KEY-SMD_4P-L6.0-W6.0-P3.90-LS9.0]  27 108 0 top
SW9  TS-1095PS-A1B2-C3D2  [KEY-SMD_4P-L6.0-W6.0-P3.90-LS9.0]  42 108 0 top
SW10  TS-1095PS-A1B2-C3D2  [KEY-SMD_4P-L6.0-W6.0-P3.90-LS9.0]  57 108 0 top
SW11  TS-1095PS-A1B2-C3D2  [KEY-SMD_4P-L6.0-W6.0-P3.90-LS9.0]  72 108 0 top
SW12  TS-1095PS-A1B2-C3D2  [KEY-SMD_4P-L6.0-W6.0-P3.90-LS9.0]  87 108 0 top
SW13  TS-1095PS-A1B2-C3D2  [KEY-SMD_4P-L6.0-W6.0-P3.90-LS9.0]  11 93 0 top
SW14  TS-1095PS-A1B2-C3D2  [KEY-SMD_4P-L6.0-W6.0-P3.90-LS9.0]  24 93 0 top
SW15  TS-1095PS-A1B2-C3D2  [KEY-SMD_4P-L6.0-W6.0-P3.90-LS9.0]  37 93 0 top
SW17  TS-1095PS-A1B2-C3D2  [KEY-SMD_4P-L6.0-W6.0-P3.90-LS9.0]  72 97 0 top
SW19  TS-1095PS-A1B2-C3D2  [KEY-SMD_4P-L6.0-W6.0-P3.90-LS9.0]  11 82 0 top
SW20  TS-1095PS-A1B2-C3D2  [KEY-SMD_4P-L6.0-W6.0-P3.90-LS9.0]  24 82 0 top
SW21  TS-1095PS-A1B2-C3D2  [KEY-SMD_4P-L6.0-W6.0-P3.90-LS9.0]  37 82 0 top
SW22  TS-1095PS-A1B2-C3D2  [KEY-SMD_4P-L6.0-W6.0-P3.90-LS9.0]  59 88 0 top
SW23  TS-1095PS-A1B2-C3D2  [KEY-SMD_4P-L6.0-W6.0-P3.90-LS9.0]  72 88 0 top
SW24  TS-1095PS-A1B2-C3D2  [KEY-SMD_4P-L6.0-W6.0-P3.90-LS9.0]  85 88 0 top
SW25  TS-1095PS-A1B2-C3D2  [KEY-SMD_4P-L6.0-W6.0-P3.90-LS9.0]  11 71 0 top
SW26  TS-1095PS-A1B2-C3D2  [KEY-SMD_4P-L6.0-W6.0-P3.90-LS9.0]  24 71 0 top
SW27  TS-1095PS-A1B2-C3D2  [KEY-SMD_4P-L6.0-W6.0-P3.90-LS9.0]  37 71 0 top
SW28  TS-1095PS-A1B2-C3D2  [KEY-SMD_4P-L6.0-W6.0-P3.90-LS9.0]  57 75 90 top
SW29  TS-1095PS-A1B2-C3D2  [KEY-SMD_4P-L6.0-W6.0-P3.90-LS9.0]  72 75 90 top
SW30  TS-1095PS-A1B2-C3D2  [KEY-SMD_4P-L6.0-W6.0-P3.90-LS9.0]  87 75 270 top
SW31  TS-1095PS-A1B2-C3D2  [KEY-SMD_4P-L6.0-W6.0-P3.90-LS9.0]  12 59 270 top
SW32  TS-1095PS-A1B2-C3D2  [KEY-SMD_4P-L6.0-W6.0-P3.90-LS9.0]  27 59 0 top
SW33  TS-1095PS-A1B2-C3D2  [KEY-SMD_4P-L6.0-W6.0-P3.90-LS9.0]  42 59 0 top
SW34  TS-1095PS-A1B2-C3D2  [KEY-SMD_4P-L6.0-W6.0-P3.90-LS9.0]  57 59 180 top
SW35  TS-1095PS-A1B2-C3D2  [KEY-SMD_4P-L6.0-W6.0-P3.90-LS9.0]  72 59 0 top
SW36  TS-1095PS-A1B2-C3D2  [KEY-SMD_4P-L6.0-W6.0-P3.90-LS9.0]  87 59 0 top
SW37  TS-1095PS-A1B2-C3D2  [KEY-SMD_4P-L6.0-W6.0-P3.90-LS9.0]  12 47 0 top
SW38  TS-1095PS-A1B2-C3D2  [KEY-SMD_4P-L6.0-W6.0-P3.90-LS9.0]  27 47 0 top
SW39  TS-1095PS-A1B2-C3D2  [KEY-SMD_4P-L6.0-W6.0-P3.90-LS9.0]  42 47 0 top
SW40  TS-1095PS-A1B2-C3D2  [KEY-SMD_4P-L6.0-W6.0-P3.90-LS9.0]  57 47 90 top
SW41  TS-1095PS-A1B2-C3D2  [KEY-SMD_4P-L6.0-W6.0-P3.90-LS9.0]  72 47 0 top
SW42  TS-1095PS-A1B2-C3D2  [KEY-SMD_4P-L6.0-W6.0-P3.90-LS9.0]  87 47 270 top
SW43  TS-1095PS-A1B2-C3D2  [KEY-SMD_4P-L6.0-W6.0-P3.90-LS9.0]  12 35 0 top
SW44  TS-1095PS-A1B2-C3D2  [KEY-SMD_4P-L6.0-W6.0-P3.90-LS9.0]  27 35 0 top
SW45  TS-1095PS-A1B2-C3D2  [KEY-SMD_4P-L6.0-W6.0-P3.90-LS9.0]  42 35 0 top
SW46  TS-1095PS-A1B2-C3D2  [KEY-SMD_4P-L6.0-W6.0-P3.90-LS9.0]  57 35 0 top
SW47  TS-1095PS-A1B2-C3D2  [KEY-SMD_4P-L6.0-W6.0-P3.90-LS9.0]  72 35 0 top
SW48  TS-1095PS-A1B2-C3D2  [KEY-SMD_4P-L6.0-W6.0-P3.90-LS9.0]  87 35 0 top
SW49  TS-1095PS-A1B2-C3D2  [KEY-SMD_4P-L6.0-W6.0-P3.90-LS9.0]  12 23 0 top
SW50  TS-1095PS-A1B2-C3D2  [KEY-SMD_4P-L6.0-W6.0-P3.90-LS9.0]  27 23 0 top
SW51  TS-1095PS-A1B2-C3D2  [KEY-SMD_4P-L6.0-W6.0-P3.90-LS9.0]  42 23 0 top
SW52  TS-1095PS-A1B2-C3D2  [KEY-SMD_4P-L6.0-W6.0-P3.90-LS9.0]  57 23 0 top
SW53  TS-1095PS-A1B2-C3D2  [KEY-SMD_4P-L6.0-W6.0-P3.90-LS9.0]  72 23 0 top
SW54  TS-1095PS-A1B2-C3D2  [KEY-SMD_4P-L6.0-W6.0-P3.90-LS9.0]  87 23 0 top
SW55  TS-1095PS-A1B2-C3D2  [KEY-SMD_4P-L6.0-W6.0-P3.90-LS9.0]  12 11 0 top
SW56  TS-1095PS-A1B2-C3D2  [KEY-SMD_4P-L6.0-W6.0-P3.90-LS9.0]  27 11 0 top
SW57  TS-1095PS-A1B2-C3D2  [KEY-SMD_4P-L6.0-W6.0-P3.90-LS9.0]  42 11 0 top
SW58  TS-1095PS-A1B2-C3D2  [KEY-SMD_4P-L6.0-W6.0-P3.90-LS9.0]  57 11 0 top
SW59  TS-1095PS-A1B2-C3D2  [KEY-SMD_4P-L6.0-W6.0-P3.90-LS9.0]  72 11 0 top
SW60  TS-1095PS-A1B2-C3D2  [KEY-SMD_4P-L6.0-W6.0-P3.90-LS9.0]  87 11 0 top
U1  ColorEasyPico2-RP2350  [COMM-TH_COLOREASYPICO2-RP2350]  70 74 90 bottom
U2  PAM8302AASCR  [MSOP-8_L3.0-W3.0-P0.65-LS5.0-BL]  36.97 126.84 0 bottom
U4  KH-2.54FH-1X14P-H8.5  [HDR-TH_14P-P2.54-V-F]  96.8 155.33 270 top

## Footprints (pads in the part's own frame, mm; a bottom-side part is the same pattern mirrored in y, then rotated)
C0603
  rect 0.8x0.9 smd: 1(-0.7,0) 2(0.7,0)
COMM-TH_COLOREASYPICO2-RP2350
  round 1.524 hole 0.914: 1(-8.889,24.131) 2(-8.889,21.591) 3(-8.889,19.052) 4(-8.889,16.512) 5(-8.889,13.972) 6(-8.889,11.431) 7(-8.889,8.892) 8(-8.889,6.351) 9(-8.889,3.812) 10(-8.889,1.272) 11(-8.889,-1.268) 12(-8.889,-3.808) 13(-8.889,-6.348) 14(-8.889,-8.889) 15(-8.889,-11.428) 16(-8.889,-13.969) 17(-8.889,-16.509) 18(-8.889,-19.049) 19(-8.889,-21.588) 20(-8.889,-24.128) 21(8.889,-24.131) 22(8.889,-21.591) 23(8.889,-19.052) 24(8.889,-16.512) 25(8.889,-13.972) 26(8.889,-11.431) 27(8.889,-8.892) 28(8.889,-6.351) 29(8.889,-3.812) 30(8.889,-1.272) 31(8.889,1.268) 32(8.889,3.808) 33(8.889,6.348) 34(8.889,8.889) 35(8.889,11.428) 36(8.889,13.969) 37(8.889,16.509) 38(8.889,19.049) 39(8.889,21.588) 40(8.889,24.128)
DO-35_BD2.2-L4.0-D0.50_1N4148
  round 1.4 hole 0.8: 1(-4,0) 2(4,0)
HDR-TH_14P-P2.54-V-F
  rect 1.8x1.8 hole 1.2: 1(-16.51,0)
  round 1.8 hole 1.2: 2(-13.97,0) 3(-11.43,0) 4(-8.89,0) 5(-6.35,0) 6(-3.81,0) 7(-1.27,0) 8(1.27,0) 9(3.81,0) 10(6.35,0) 11(8.89,0) 12(11.43,0) 13(13.97,0) 14(16.51,0)
KEY-SMD_4P-L6.0-W6.0-P3.90-LS9.0
  rect 2x1.2 smd: 1(-4.3,1.95) 2(4.3,1.95) 3(-4.3,-1.95) 4(4.3,-1.95)
MSOP-8_L3.0-W3.0-P0.65-LS5.0-BL
  oval 0.364x1.692 smd: 1(-0.975,-2.146) 2(-0.325,-2.146) 3(0.325,-2.146) 4(0.975,-2.146) 5(0.975,2.146) 6(0.325,2.146) 7(-0.325,2.146) 8(-0.975,2.146)
R0603
  rect 0.806x0.864 smd: 1(-0.753,0) 2(0.753,0)
SOT-23-3_L2.9-W1.3-P1.90-LS2.4-BR
  rect 1.25x0.7 smd: 1(1,-0.95) 2(1,0.95) 3(-1,0)
SPK-TH_BD23.0-P10.00-D0.8-L-RD
  rect 2.5x2.5 hole 1.1: 1(-5,0)
  round 2.5 hole 1.1: 2(5,0)

## Nets
As in the schematic.

Pads without a net: U1 30 32 35 37 39 40; U2 2; U4 10 11 12 13 14

## Via types
v1: diameter 0.61, hole 0.305, Top Layer to Bottom Layer, 42 vias

## Routing (per net, layer and track width the routed paths; a pad name or vN(x,y) marks a point on that pad's centre or on a via; arc(x,y) is an arc through that point)
3V3: length 213.1
  Bottom Layer w0.254: U2.6 37.29,125.45 38.14,126.3 43.86,126.3 46.4,128.84 49.95,128.84 50.97,127.83 ; C3.1 36.06,64.76 37.32,64.76 41.38,60.7 C4.1 49.34,61.04 50.95,61.04 54.76,64.85 54.76,65.36 55.77,66.38 67.46,66.38 U1.36 56.28,110.57 54.5,110.57 50.97,114.11 50.97,127.83 ; U4.1 98.07,170.57 98.07,168.88 97.31,168.12 86.76,168.12 55.77,137.13 55.77,135.61 56.54,134.84 ; 56.54,134.84 56.03,134.34 Q1.2 ; 56.54,134.84 57.04,135.35 57.81,135.35 58.06,135.1 58.06,131.39 55.52,128.85 51.73,128.85 R3.2 50.97,127.83
GND: length 260.4
  Inner1 w0.254: v1(80.16,84.16) 87.78,84.16 U1.38 89.05,65.62 ; 89.05,65.62 89.05,65.11 ; 89.05,65.62 88.29,66.38 77.62,66.38 U1.8 75.08,66.38 64.92,66.38 U1.13 62.38,66.38 52.22,66.38 U1.18 50.95,61.3 v1(49.94,60.29)
  Inner2 w0.254: U1.23 52.22,84.16 62.38,84.16 U1.28 64.92,84.16 75.08,84.16 U1.33 77.62,84.16 v1(80.16,84.16)
  Bottom Layer w0.254: U1.23 50.69,82.89 36.65,96.94 U2.7 36.65,126.98 35.38,128.25 35.38,129.77 41.89,136.29 52.48,136.29 52.73,136.04 ; R4.1 51.97,132.59 51.97,134.26 52.73,135.02 52.73,136.04 ; C3.2 41.4,59.3 C4.2 49.94,60.24 v1(49.94,60.29) ; 52.73,136.04 86,169.3 U4.2
AMPGPIO: length 85.5
  Inner1 w0.254: U1.21 47.14,81.62 48.66,81.62 49.68,82.63 49.68,92.29 47.9,94.06 47.9,97.87 54.97,104.94 v1(54.97,111.29) 54.97,117.9 43.88,128.98 39.57,128.98 v1(38.81,128.22)
  Bottom Layer w0.254: U2.1 36,128.24 36.52,127.71 38.3,127.71 v1(38.81,128.22) ; v1(54.97,111.29) R4.2
BL: length 47.7
  Bottom Layer w0.254: U4.8 79.08,136.34 Q1.3
BL_GPIO: length 58.4
  Bottom Layer w0.254: R2.2 50.19,124.87 50.19,111.59 U1.34
C0: length 139.9
  Top Layer w0.254: v1(68.08,121.75) 67.83,122 D4.2 60.47,124.53 40.1,124.53 35.52,119.95 v1(35.52,109.29)
  Inner2 w0.254: D5.2 68.25,121.75 v1(68.08,121.75) ; D5.2 79,106.94 92.86,93.07 92.86,66.38 U1.1 ; D5.2 80,111 D6.2 ; v1(35.52,109.29) 34,107.76 D3.2 30,103 D2.2 26,98 D1.2
C1: length 148.4
  Inner2 w0.254: D10.2 37.46,108.46 37.3,108.46 ; U1.2 87.95,68.75 87.95,95.63 82.37,101.22 76.78,101.22 D11.2 73.98,104.02 61,104.02 59.99,103 57.95,103 55.92,105.03 48.56,105.03 46,102.48 D9.2 43.76,102 37.3,108.46 ; 37.3,108.46 34.76,111 D12.2 26,103 D8.2 7,103 D7.2
C2: length 91.1
  Top Layer w0.254: U1.4 76.23,75.39 v1(75.48,75.39)
  Inner2 w0.254: 48.81,101.81 v1(49.32,101.81) ; 48.81,101.81 48.81,103.81 D17.2 ; 48.81,101.81 D15.2 35,88 D14.2 31.98,89.02 21.02,89.02 D13.2
  Bottom Layer w0.254: v1(75.48,75.39) 74.72,75.39 67.61,82.51 67.61,83.01 55.92,94.69 55.92,95.21 v1(49.32,101.81)
C3: length 129.7
  Inner2 w0.254: D19.2 16.91,78.09 26.91,78.09 D21.2 29.02,75.98 32.57,75.98 33.59,77 D20.2 40,83 D24.2 43.5,95 D23.2 51.03,102.53 61.03,102.53 D22.2 64.8,103 v1(72.17,95.63)
  Bottom Layer w0.254: U1.5 85.24,66.38 85.24,83.19 72.8,95.63 v1(72.17,95.63)
C4: length 141.8
  Inner2 w0.254: 25.05,62.95 28,60 D26.2 ; 25.05,62.95 38,75.91 40.54,75.91 47.15,82.51 47.15,85.15 D28.2 58.02,93.98 79.98,93.98 D30.2 ; 25.05,62.95 D27.2 11,77 D25.2 ; D30.2 81,83.98 80.16,83.14 80.16,66.38 U1.6 ; D30.2 81,99 D29.2
C5: length 100.1
  Top Layer w0.254: v1(70.6,53) D36.2
  Inner1 w0.254: v1(70.6,53) 70.6,56.82 U1.7
  Inner2 w0.254: 48.78,51.91 48.78,52.78 D34.2 ; 48.78,51.91 48.78,51.4 47,49.62 D33.2 45.98,43.02 33.02,43.02 D32.2 31,41 18.43,41 17.41,42.02 8.02,42.02 D31.2 ; 48.78,51.91 62.91,51.91 D35.2 69.35,52 70.35,53 v1(70.6,53)
C6: length 121.3
  Top Layer w0.254: v1(70.68,29.57) 75.68,29.57
  Inner1 w0.254: U1.9 70,61.3 70,33.29 73.72,29.57 ; 73.72,29.57 80.84,29.57 81.85,30.58 89.32,30.58 D42.2 ; 73.72,29.57 v1(70.68,29.57)
  Inner2 w0.254: v1(70.68,29.57) 70.42,29.57 69.41,28.55 62.04,28.55 D40.2 60.01,28.55 52.47,28.55 51.45,29.57 D39.2 45.35,30.58 32.73,30.58 D38.2 30.7,30.58 17.9,30.58 D37.2
C7: length 127.4
  Inner2 w0.254: 71.18,17.53 70.93,17.53 69.91,18.54 62.04,18.54 D46.2 60.01,16.51 47.39,16.51 D45.2 45.35,16.51 32.73,16.51 D44.2 30.72,18.52 23.13,18.52 21.6,17 D43.2 ; 71.18,17.53 73.68,17.53 74.69,16.51 89.32,16.51 D48.2 ; 71.18,17.53 71.27,17.62 U1.10
C8: length 130.9
  Inner1 w0.254: 67.97,10 D54.2 ; 67.97,10 68.73,10.76 68.73,30.07 68,30.8 D53.2 68,64.38 U1.11 ; 67.97,10 54,10 D52.2 D51.2 D50.2 17.98,16.02 17.98,25.98 D49.2
C9: length 108.4
  Inner1 w0.254: D55.2 21,40 D57.2 36.02,38.98 36.02,29.02 D56.2 D58.2 49.51,28.51 ; 49.51,28.51 61,40 D60.2 61,59.92 U1.12 ; 49.51,28.51 49.51,27.6 62.57,14.54 63.59,14.54 D59.2
CS: length 98.8
  Top Layer w0.254: U4.3 95.53,165.49 v1(95.53,148.3)
  Inner1 w0.254: U1.27 61.36,82.89 95.53,117.06 v1(95.53,148.3)
DC: length 92.7
  Inner1 w0.254: U1.29 66.44,82.89 98.07,114.52 98.07,160.41 U4.5
INPLUS: length 48.7
  Inner1 w0.254: v1(43.73,128.21) 42.97,127.44 42.97,97.47 48.41,92.03 U1.22
  Bottom Layer w0.254: R1.2 43.09,128.21 v1(43.73,128.21)
MISO: length 84.5
  Inner1 w0.254: U1.26 58.57,84.16 94.89,120.48 94.89,149.61 U4.9
MOSI: length 93.3
  Inner1 w0.254: U4.6 95.4,157.74 95.4,154.52 94.38,153.5 94.38,120.99 56.28,82.89 U1.25
R0: length 254.7
  Top Layer w0.254: 7.92,48.95 5.89,46.92 5.89,39.3 7.66,37.52 7.66,37.01 ; 7.92,48.95 SW37.2 ; 7.92,48.95 SW37.1 ; 16.82,68.63 16.82,71.43 SW25.2 16.05,73.7 16.05,77.44 15.28,78.2 14.78,78.2 12.24,75.66 6.65,75.66 ; 16.82,68.63 16.82,66.17 SW31.1 SW31.2 13.95,51.3 SW37.2 ; 16.82,68.63 17.08,68.63 v1(20.6,65.11) ; SW49.1 SW49.2 ; SW49.1 6.18,23.43 6.18,19.36 8.21,17.33 8.21,13.46 SW55.1 SW55.2 ; SW49.1 6.39,26.26 6.39,35.74 7.66,37.01 ; 15.28,94.97 SW13.2 ; 15.28,94.97 6.9,94.97 ; 15.28,94.97 15.28,95.13 14.52,95.89 14.52,100.97 ; 6.65,84.04 6.65,84.3 5.38,85.57 5.38,93.44 6.9,94.97 ; 6.65,84.04 SW19.1 SW19.2 ; 6.65,84.04 5.38,82.77 5.38,77.19 6.65,75.92 6.65,75.66 ; 6.65,75.66 6.65,73 SW25.1 ; SW1.2 SW1.1 17.82,114.53 17.82,107.57 SW7.1 16.3,102.75 14.52,100.97 ; SW37.2 17.82,47.43 17.82,38.47 SW43.2 ; 14.52,100.97 12.78,100.97 SW7.2 ; 6.9,94.97 SW13.1 ; 7.66,37.01 SW43.1
  Inner1 w0.254: v1(20.6,65.11) 26.19,59.52 55.52,59.52 U1.14
R1: length 247.9
  Top Layer w0.254: SW38.1 21.18,50.47 21.18,59.43 SW32.1 ; SW38.1 SW38.2 32.82,47.43 32.82,44.38 30.79,42.35 30.79,37.46 SW44.2 32.82,35.43 32.82,26.47 SW50.2 32.82,23.43 32.82,20.38 28.25,15.81 ; SW38.1 21.18,47.43 21.18,38.47 SW44.1 21.18,35.43 21.18,26.47 SW50.1 ; SW20.1 18.18,85.47 18.18,93.43 SW14.1 SW14.2 32.82,99.47 32.82,108.43 SW8.2 SW8.1 21.18,111.47 21.18,118.43 SW2.1 SW2.2 ; SW20.1 18.18,82.43 18.18,74.47 SW26.1 ; SW20.1 SW20.2 ; 28.25,15.81 25.4,12.95 SW56.1 ; 28.25,15.81 28.44,15.81 SW56.2 ; SW26.1 SW26.2 ; SW26.1 18.18,71.43 18.18,68.38 22.7,63.85 SW32.1 ; v1(31.3,61.97) SW32.2 SW32.1
  Inner2 w0.254: U1.15 57.4,66.28 35.62,66.28 v1(31.3,61.97)
R2: length 243.1
  Top Layer w0.254: SW15.1 38.05,100.3 38.21,100.3 ; 46.19,60.95 SW33.2 48.59,60.95 v1(52.14,64.51) ; 46.19,60.95 47.71,59.43 47.71,50.36 SW39.2 47.82,47.43 47.82,44.38 45.79,42.35 45.79,37.46 SW45.2 47.82,35.43 47.82,26.47 SW51.2 47.82,23.43 47.82,20.38 43.25,15.81 ; 46.19,60.95 40.79,66.35 ; 37.74,76.33 37.92,76.33 SW27.2 42.82,71.43 42.82,68.38 40.79,66.35 ; 37.74,76.33 34.36,72.95 SW27.1 ; 37.74,76.33 39.52,78.11 41.55,78.11 42.82,79.38 42.82,82.43 SW21.2 40.54,84.71 40.54,84.93 ; SW51.1 36.94,25.71 36.94,31.62 36.18,32.38 36.18,35.43 SW45.1 36.18,38.47 36.18,47.43 SW39.1 37.7,54.85 36.18,56.38 36.18,59.43 SW33.1 37.7,63.25 40.79,66.35 ; 40.54,84.93 39.56,83.95 SW21.1 ; 40.54,84.93 43.33,87.72 44.35,87.72 46.13,89.5 46.13,90.26 41.44,94.95 SW15.2 41.3,97.21 38.21,100.3 ; 43.25,15.81 43.44,15.81 SW57.2 ; 43.25,15.81 40.4,12.95 SW57.1 ; 38.21,100.3 36.18,102.33 36.18,108.43 SW9.1 ; SW9.1 SW9.2 ; SW9.1 36.18,111.47 36.18,118.43 SW3.1 41.76,124.01 44.56,124.01 46.3,122.27 SW3.2
  Inner1 w0.254: U1.16 54.92,64 52.65,64 v1(52.14,64.51)
R3: length 183
  Top Layer w0.254: 54.99,54.76 SW34.2 51.24,58.51 51.24,61.56 53.53,63.84 53.53,65.11 ; 54.99,54.76 54.99,51.36 SW40.2 SW40.1 ; 54.99,54.76 59.01,54.76 SW34.1 ; SW40.1 53.27,42.7 52,41.43 52,37.65 SW46.1 51.18,35.43 51.18,27.81 52.7,26.28 52.7,25.01 ; SW40.1 60.8,36.95 SW46.2 ; SW52.2 61.24,25.01 53.21,25.01 ; 53.53,65.11 U1.17 ; 53.53,65.11 53.53,65.37 55.05,66.89 SW28.1 SW28.2 52.41,81.94 52.41,83.85 52.67,84.11 52.67,87.92 SW22.1 ; SW22.1 SW22.2 ; SW22.1 54.7,100.05 59.01,104.36 61.81,104.36 62.82,105.38 62.82,108.43 SW10.2 SW10.1 52.7,113.6 51.18,115.12 51.18,118.43 SW4.1 SW4.2 ; 52.7,25.01 53.21,25.01 ; 52.7,25.01 SW52.1 ; 53.21,25.01 54.22,24 54.22,14.47 SW58.1 SW58.2
R4: length 223.6
  Top Layer w0.254: SW53.1 66.18,26.47 66.18,35.43 SW47.1 ; SW53.1 66.18,23.43 66.18,20.38 67.7,18.85 SW59.1 SW59.2 ; SW53.1 SW53.2 ; 69.79,53.08 69.79,52.82 73.6,49.01 76.24,49.01 SW41.2 ; 69.79,53.08 67.7,50.98 SW41.1 67.7,47.17 66.18,45.65 66.18,38.47 SW47.1 ; 69.79,53.08 70.3,53.58 75.03,53.58 77.82,56.38 77.82,59.43 SW35.2 SW35.1 67.7,64.16 ; SW23.2 74.92,91.33 74.78,91.33 ; SW47.1 SW47.2 ; 67.7,64.16 67.7,64.92 67.51,65.11 67.51,68.16 SW29.1 SW29.2 67.45,81.9 67.45,84.11 66.18,85.38 66.18,88.43 SW23.1 73.4,89.95 74.78,91.33 ; 67.7,64.16 66.94,63.4 v1(54.24,63.4) ; SW11.1 65.92,108.17 65.92,100.73 SW17.1 SW17.2 77.82,97.43 77.82,94.38 74.78,91.33 ; SW11.1 66.18,111.47 66.18,118.43 SW5.1 SW5.2 ; SW11.1 SW11.2
  Inner2 w0.254: U1.19 50.12,63.4 v1(54.24,63.4)
R5: length 229.8
  Top Layer w0.254: 87.74,28.47 84.22,24.95 SW54.1 ; 87.74,28.47 90.03,30.76 91.05,30.76 92.82,32.53 92.82,35.43 SW48.2 ; 87.74,28.47 87.78,28.47 SW54.2 92.82,23.43 92.82,20.38 91.05,18.6 89.78,18.6 87.74,16.57 ; 91.08,109.95 SW12.2 ; 91.08,109.95 SW12.1 83.21,110.46 83.21,113.35 81.18,115.38 81.18,118.43 SW6.1 SW6.2 ; 91.08,109.95 92.61,108.43 92.61,100.04 89.05,96.49 ; 87.74,16.57 84.13,12.95 SW60.1 ; 87.74,16.57 87.74,16.51 SW60.2 ; SW48.2 SW48.1 ; SW48.2 88.95,39.3 SW42.2 SW42.1 92.82,55.17 92.82,59.43 SW36.2 91.24,61.05 ; SW24.1 SW24.2 87.78,91.47 87.78,95.22 89.05,96.49 ; 91.24,61.05 82.8,61.05 SW36.1 79.65,64 v1(69.49,64) ; 91.24,61.05 91.24,61.3 90.47,62.06 90.47,69.18 SW30.2 SW30.1 90.32,80.67 90.32,84.3 91.08,85.06 91.08,94.46 89.05,96.49
  Inner2 w0.254: U1.20 48.25,62.73 68.22,62.73 v1(69.49,64)
RST: length 93
  Top Layer w0.254: v1(96.8,112.23) 98.07,113.5 98.07,162.95 U4.4
  Inner1 w0.254: v1(96.8,112.23) 71.27,86.7 U1.31
SCK: length 91.8
  Inner1 w0.254: v1(94.64,154.69) 93.87,153.93 93.87,123.27 U1.24
  Bottom Layer w0.254: v1(94.64,154.69) 94.89,154.69 U4.7
$1N8407: length 33.2
  Top Layer w0.254: SW1.3 SW1.4 6.17,118.42 6.17,105.37 11,100.54 D1.1
$1N10171: length 23
  Top Layer w0.254: 22.76,115.97 22.51,115.72 v1(22.51,111.65) ; 22.76,115.97 31.22,115.97 SW2.4 ; 22.76,115.97 SW2.3
  Bottom Layer w0.254: v1(22.51,111.65) 22,111.14 D2.1
$1N10276: length 11.4
  Top Layer w0.254: SW4.3 SW4.4 63,114.35 D4.1
$1N10284: length 27.2
  Top Layer w0.254: SW3.4 SW3.3 v1(37.7,114.64)
  Inner1 w0.254: v1(37.7,114.64) 37.7,108.29 34,104.59 D3.1
$1N10390: length 12.2
  Top Layer w0.254: SW6.4 90,114.75 D6.1 85.75,113 SW6.3
$1N10398: length 22.8
  Top Layer w0.254: D5.1 79,109.35 76.3,112.05 SW5.4 SW5.3
$1N11038: length 11.9
  Top Layer w0.254: D11.1 67,105.35 SW11.3 SW11.4
$1N11044: length 70.2
  Top Layer w0.254: v1(46.45,118.75) 49.49,118.75 51.7,120.96 77.51,120.96 80.74,117.73 80.74,108.01 SW12.3 SW12.4
  Inner2 w0.254: v1(46.45,118.75) 46.19,119 D12.1
$1N11054: length 29.3
  Top Layer w0.254: D10.1 44,120.21 47.05,117.16 47.3,117.16 51.37,113.09 51.37,107.38 SW10.3 SW10.4
$1N11060: length 12.8
  Top Layer w0.254: SW9.4 SW9.3 38,105.75 D9.1
$1N11066: length 15.1
  Top Layer w0.254: D8.1 19,109.75 SW8.3 SW8.4
$1N11072: length 17.4
  Top Layer w0.254: SW7.4 10.57,107.08 15.02,107.08 ; 15.02,107.08 15.02,108.67 SW7.3 ; 15.02,107.08 15.02,106.57 14,105.56 D7.1
$1N11320: length 22.6
  Top Layer w0.254: SW13.4 SW13.3 ; v1(17.59,91.05) 15.3,91.05
  Inner1 w0.254: D13.1 24.95,91.05 v1(17.59,91.05)
$1N11326: length 22.6
  Top Layer w0.254: SW14.3 SW14.4 29.32,90.03 38.97,90.03 D14.1
$1N11332: length 12.7
  Top Layer w0.254: SW15.3 SW15.4 42.35,90 D15.1
$1N11344: length 34.3
  Top Layer w0.254: SW17.4 SW17.3 59.16,103.59 v1(59.16,103.62)
  Inner2 w0.254: D17.1 50.78,112 v1(59.16,103.62)
$1N11596: length 17.9
  Top Layer w0.254: D19.1 16.78,86.22 16.78,81.53 SW19.4 SW19.3
$1N11602: length 13.6
  Top Layer w0.254: SW20.3 SW20.4 31.35,77 D20.1
$1N11608: length 26.1
  Top Layer w0.254: D21.1 21.02,75.98 32.45,75.98 33.21,76.75 33.21,79.54 SW21.3 SW21.4
$1N11614: length 19.5
  Top Layer w0.254: SW22.3 SW22.4 64.8,87.55 64.8,91.7 D22.1
$1N11620: length 27.5
  Top Layer w0.254: v1(67.67,87.29) 67.67,86.08 SW23.3 SW23.4
  Bottom Layer w0.254: D23.1 57,97.96 v1(67.67,87.29)
$1N11626: length 38
  Top Layer w0.254: v1(78.62,86.05) SW24.3 SW24.4
  Inner2 w0.254: D24.1 78.17,86.5 v1(78.62,86.05)
$1N11872: length 17.5
  Top Layer w0.254: 15.25,69.13 SW25.4 ; 15.25,69.13 15.25,69.63 13.98,70.9 13.98,75.98 D25.1 ; 15.25,69.13 6.78,69.13 SW25.3
$1N11878: length 26.8
  Top Layer w0.254: D26.1 32.7,57.3 32.7,61.62 28.3,66.02 SW26.4 SW26.3
$1N11884: length 12.8
  Top Layer w0.254: D27.1 30,66.35 SW27.3 SW27.4
$1N11890: length 30.8
  Top Layer w0.254: SW28.3 SW28.4 58.74,79.51 57.89,79.51 54.84,82.55 54.84,83.82 53.32,85.35 53.32,86.87 55.1,88.65 v1(55.35,88.65)
  Inner1 w0.254: D28.1 v1(55.35,88.65)
$1N11896: length 37
  Top Layer w0.254: SW29.3 SW29.4 75.01,80.36 75.01,83.24 75.78,84 76.28,84 77.81,85.52 77.81,89.08 88.73,100 D29.1
$1N11902: length 27.7
  Top Layer w0.254: D30.1 90.64,93.36 90.64,85.21 89.37,83.94 88.61,83.94 87.59,82.92 87.59,81.84 SW30.3 SW30.4
$1N12148: length 24.4
  Top Layer w0.254: SW31.3 SW31.4 10.17,54.58 v1(10.17,49.64)
  Bottom Layer w0.254: D31.1 15,44.81 v1(10.17,49.64)
$1N12154: length 24.2
  Top Layer w0.254: v1(22.73,51.4) 22.73,57.02 SW32.3 SW32.4
  Inner2 w0.254: D32.1 24,50.13 v1(22.73,51.4)
$1N12160: length 24.2
  Top Layer w0.254: D33.1 39,55.75 SW33.3 SW33.4
$1N12166: length 26.1
  Top Layer w0.254: v1(52.7,58.61) SW34.4 SW34.3
  Bottom Layer w0.254: v1(52.7,58.61) 52.7,48.7 D34.1
$1N12172: length 23.6
  Top Layer w0.254: SW35.4 SW35.3 66.3,55.65 66.3,47.3 D35.1
$1N12178: length 22.2
  Top Layer w0.254: D36.1 82.7,48.7 SW36.3 SW36.4
$1N12424: length 24.8
  Top Layer w0.254: D37.1 9.14,29.82 9.14,43.61 SW37.3 SW37.4
$1N12430: length 24.9
  Top Layer w0.254: D38.1 24.22,30.08 24.22,37.44 22.7,38.97 SW38.3 SW38.4
$1N12436: length 26.8
  Top Layer w0.254: D39.1 39.13,30.33 39.13,38.97 37.7,40.4 37.7,41.16 ; 37.7,41.16 37.95,40.91 42.16,40.91 SW39.4 ; 37.7,41.16 SW39.3
$1N12442: length 24.2
  Top Layer w0.254: SW40.4 SW40.3 58.87,42.62 v1(58.87,39.73)
  Inner2 w0.254: D40.1 53.02,33.89 v1(58.87,39.73)
$1N12448: length 24.7
  Top Layer w0.254: SW41.4 SW41.3 66.92,44.27 v1(66.92,41.51)
  Bottom Layer w0.254: v1(66.92,41.51) 66.92,30.33 D41.1
$1N12454: length 25.5
  Top Layer w0.254: D42.1 84.11,31.35 84.11,33.89 82.08,35.92 81.57,35.92 81.32,36.17 81.32,38.97 SW42.4 SW42.3
$1N12700: length 27.4
  Top Layer w0.254: SW43.3 v1(7.7,29.38) 7.7,29.13 8.46,28.37 11.62,28.37 SW43.4
  Inner2 w0.254: D43.1 7,28.43 7.7,29.13 v1(7.7,29.38)
$1N12706: length 26.7
  Top Layer w0.254: 23.97,25.91 23.97,25.66 24.22,25.4 24.22,18.04 D44.1 ; 23.97,25.91 24.16,25.91 SW44.4 ; 23.97,25.91 22.7,27.18 SW44.3
$1N12712: length 27.1
  Top Layer w0.254: 37.86,28.45 37.35,28.96 37.35,32.7 SW45.3 ; 37.86,28.45 41.7,28.45 SW45.4 ; 37.86,28.45 37.86,28.2 39.13,26.93 39.13,18.29 D45.1
$1N12718: length 24.8
  Top Layer w0.254: SW46.4 SW46.3 52.01,32.36 52.01,27.94 v1(52.77,27.18)
  Inner2 w0.254: D46.1 53.02,26.93 v1(52.77,27.18)
$1N12724: length 25.4
  Top Layer w0.254: SW47.4 74.75,31.5 v1(68.98,31.5) 68.98,31.77 SW47.3
  Bottom Layer w0.254: v1(68.98,31.5) 68.73,31.24 68.73,20.58 D47.1
$1N12730: length 28.4
  Top Layer w0.254: 81.57,28.45 81.57,28.7 81.32,28.96 81.32,31.67 SW48.3 ; 81.57,28.45 86.7,28.45 SW48.4 ; 81.57,28.45 81.57,27.94 81.32,27.69 81.32,18.54 D48.1
$1N12976: length 12.1
  Top Layer w0.254: SW49.3 SW49.4 18.35,19 D49.1
$1N12982: length 26
  Top Layer w0.254: 22.7,16.54 SW50.3 ; 22.7,16.54 26.79,16.54 SW50.4 ; 22.7,16.54 22.7,16.29 21.29,14.87 21.29,9.29 D50.1
$1N12988: length 27.3
  Top Layer w0.254: v1(37.3,10.3) 36.29,11.32 36.29,13.6 37.56,14.87 37.56,16.4 ; 37.56,16.4 37.56,16.91 37.3,17.16 37.3,20.65 SW51.3 ; 37.56,16.4 41.65,16.4 SW51.4
  Inner2 w0.254: D51.1 v1(37.3,10.3)
$1N12994: length 25.5
  Top Layer w0.254: SW52.3 51.94,20.29 v1(51.94,19.84) ; v1(54.99,20.86) 61.11,20.86 SW52.4
  Bottom Layer w0.254: v1(54.99,20.86) 53.72,19.59 52.19,19.59 ; D52.1 51.94,9.94 51.94,19.08 52.19,19.34 52.19,19.59 ; 52.19,19.59 v1(51.94,19.84)
$1N13000: length 29.9
  Top Layer w0.254: D53.1 77.78,39.22 77.78,22.53 SW53.4 SW53.3
$1N13006: length 18.1
  Top Layer w0.254: SW54.4 91.04,20.79 82.81,20.79 ; D54.1 80.52,16.48 82.81,16.48 83.32,16.98 83.32,19.27 82.81,19.78 82.81,20.79 ; 82.81,20.79 SW54.3
$1N13252: length 35.5
  Top Layer w0.254: SW55.3 SW55.4 20.02,12.77 20.02,32.98 D55.1
$1N13258: length 21.1
  Top Layer w0.254: SW56.3 SW56.4 35,12.75 D56.1
$1N13264: length 32.9
  Top Layer w0.254: SW57.4 SW57.3 35.76,10.99 35.76,14.22 36.02,14.47 36.02,30.98 D57.1
$1N13270: length 21.1
  Top Layer w0.254: SW58.4 SW58.3 51.29,10.46 51.29,17.71 D58.1
$1N13276: length 13.7
  Top Layer w0.254: SW59.4 SW59.3 65.14,6.49 D59.1
$1N13282: length 62.1
  Top Layer w0.254: D60.1 59.86,34.14 62.4,34.14 64.68,31.86 64.68,13.82 68.49,10.01 77.38,10.01 78.4,9 82.65,9 SW60.3 SW60.4
$1N22901: length 22.2
  Bottom Layer w0.254: SPK1.2 16.19,124.69 U2.8
$1N22906: length 15.2
  Top Layer w0.254: SPK1.1 36.76,123 v1(38.45,124.69)
  Bottom Layer w0.254: v1(38.45,124.69) U2.5
$1N23027: length 11.8
  Bottom Layer w0.254: U2.3 37.33,129.02 37.33,129.69 43.18,135.54 C1.1
$1N23100: length 5.8
  Bottom Layer w0.254: R1.1 45.97,132.59 C1.2
$1N23235: length 18.4
  Bottom Layer w0.254: U2.4 39.52,128.98 41.3,127.2 43.59,127.2 44.35,127.97 44.35,128.22 51.67,135.54 C2.1
$1N52039: length 12.4
  Top Layer w0.254: v1(54.37,131.29) v1(53.36,130.27)
  Bottom Layer w0.254: Q1.1 v1(54.37,131.29) ; v1(53.36,130.27) 51.65,130.27 R3.1 R2.1
